# EAGLE design Athena-A1 (EAGLE 9.6.2)

## Sheet 1 of 6
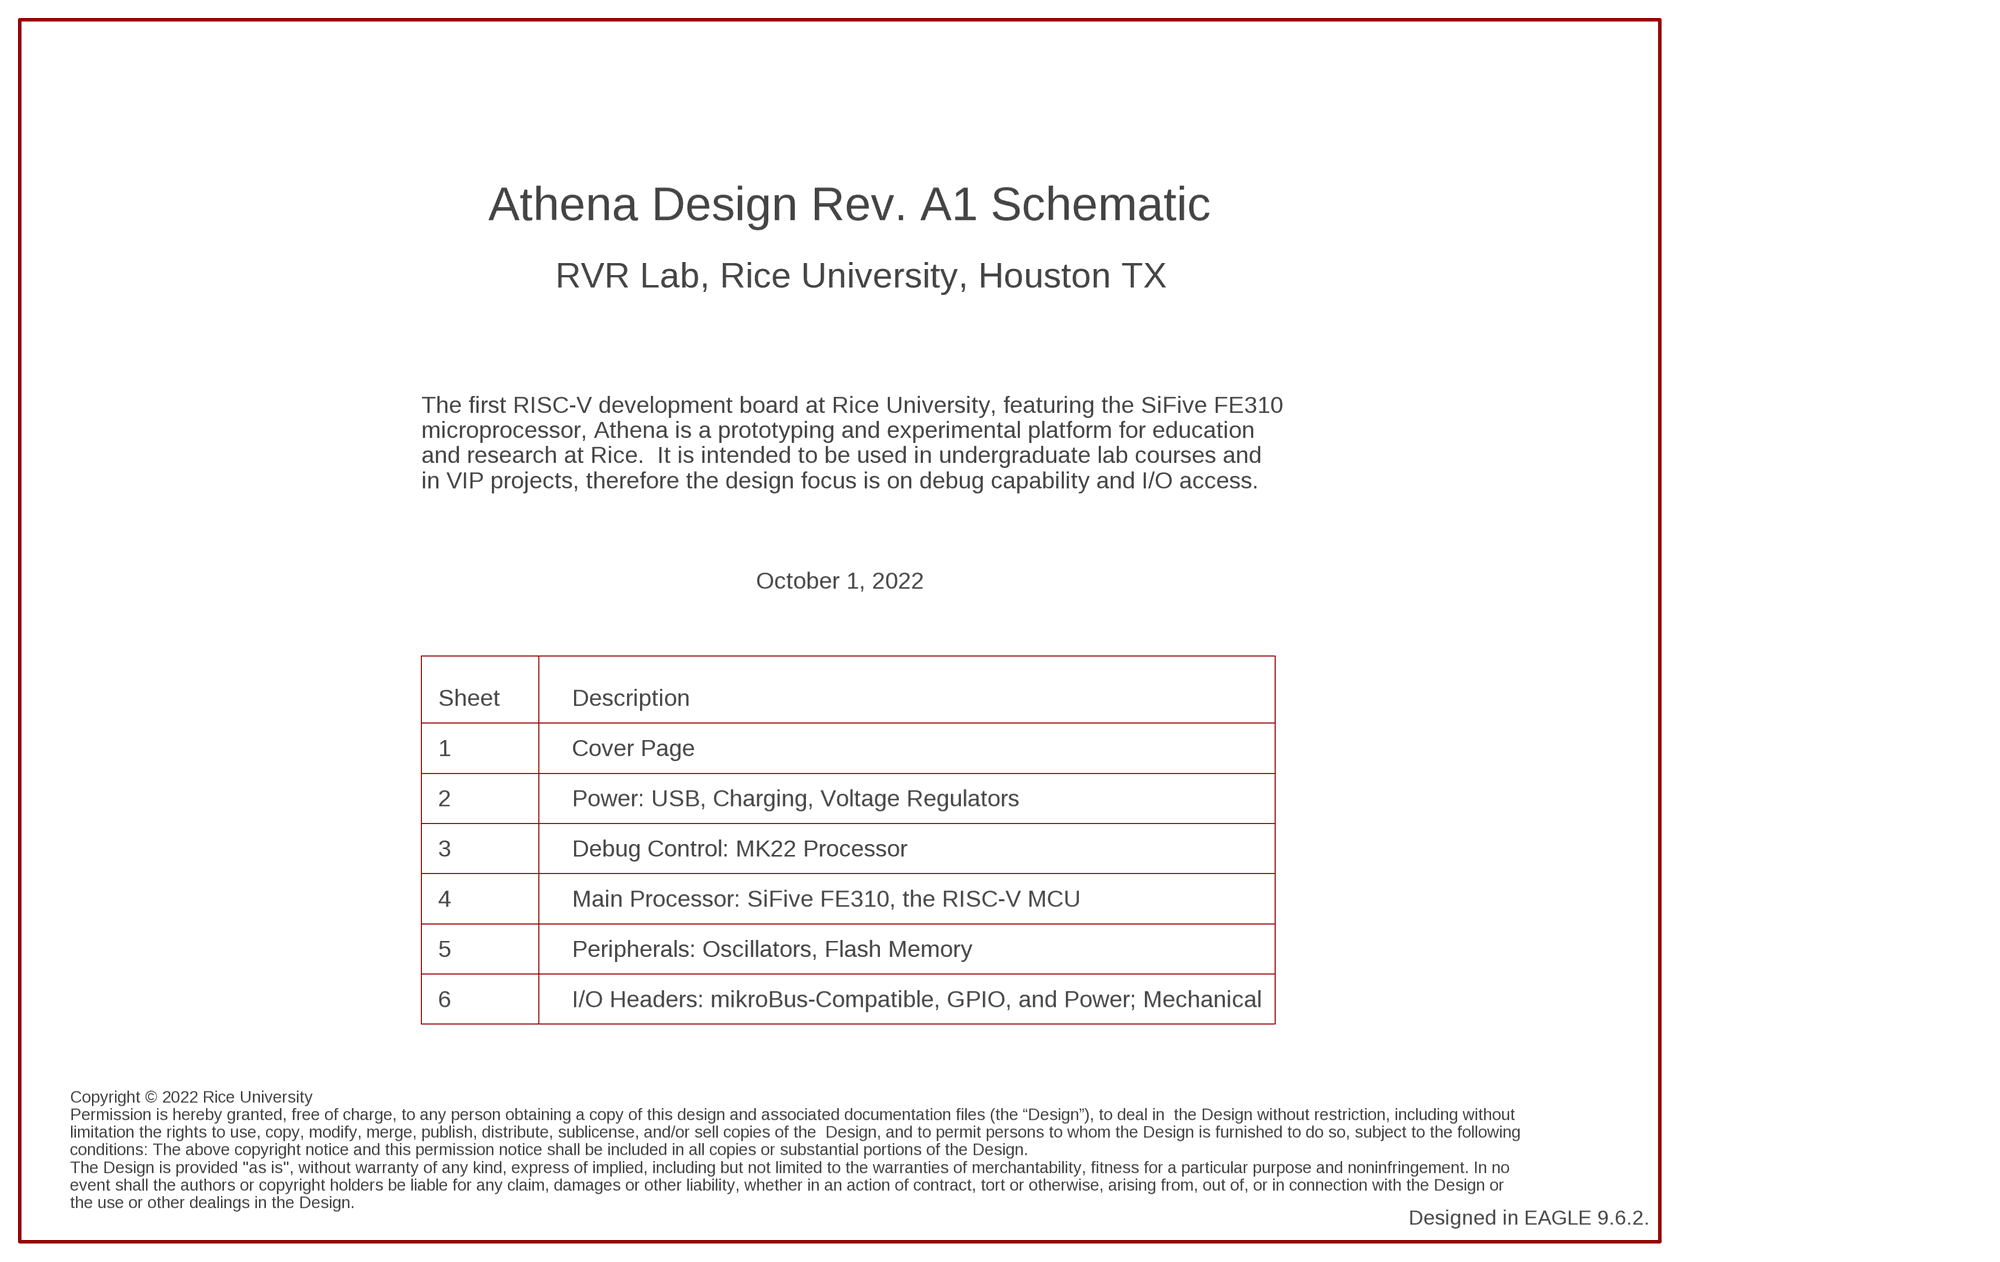
[diagram p0: schematic, sheet 1]

### Notes on the sheet
- Athena Design Rev. A1 Schematic
- RVR Lab, Rice University, Houston TX
- The first RISC-V development board at Rice University, featuring the SiFive FE310
  microprocessor, Athena is a prototyping and experimental platform for education
  and research at Rice.  It is intended to be used in undergraduate lab courses and
  in VIP projects, therefore the design focus is on debug capability and I/O access.
- October 1, 2022
- Sheet | Description
- 1 | Cover Page
- 2 | Power: USB, Charging, Voltage Regulators
- 3 | Debug Control: MK22 Processor
- 4 | Main Processor: SiFive FE310, the RISC-V MCU
- 5 | Peripherals: Oscillators, Flash Memory
- 6 | I/O Headers: mikroBus-Compatible, GPIO, and Power; Mechanical
- Copyright © 2022 Rice University
  Permission is hereby granted, free of charge, to any person obtaining a copy of this design and associated documentation files (the “Design”), to deal in  the Design without restriction, including without 
  limitation the rights to use, copy, modify, merge, publish, distribute, sublicense, and/or sell copies of the  Design, and to permit persons to whom the Design is furnished to do so, subject to the following 
  conditions: The above copyright notice and this permission notice shall be included in all copies or substantial portions of the Design.
  The Design is provided "as is", without warranty of any kind, express of implied, including but not limited to the warranties of merchantability, fitness for a particular purpose and noninfringement. In no 
  event shall the authors or copyright holders be liable for any claim, damages or other liability, whether in an action of contract, tort or otherwise, arising from, out of, or in connection with the Design or 
  the use or other dealings in the Design.
- Designed in EAGLE 9.6.2.

## Sheet 2 of 6
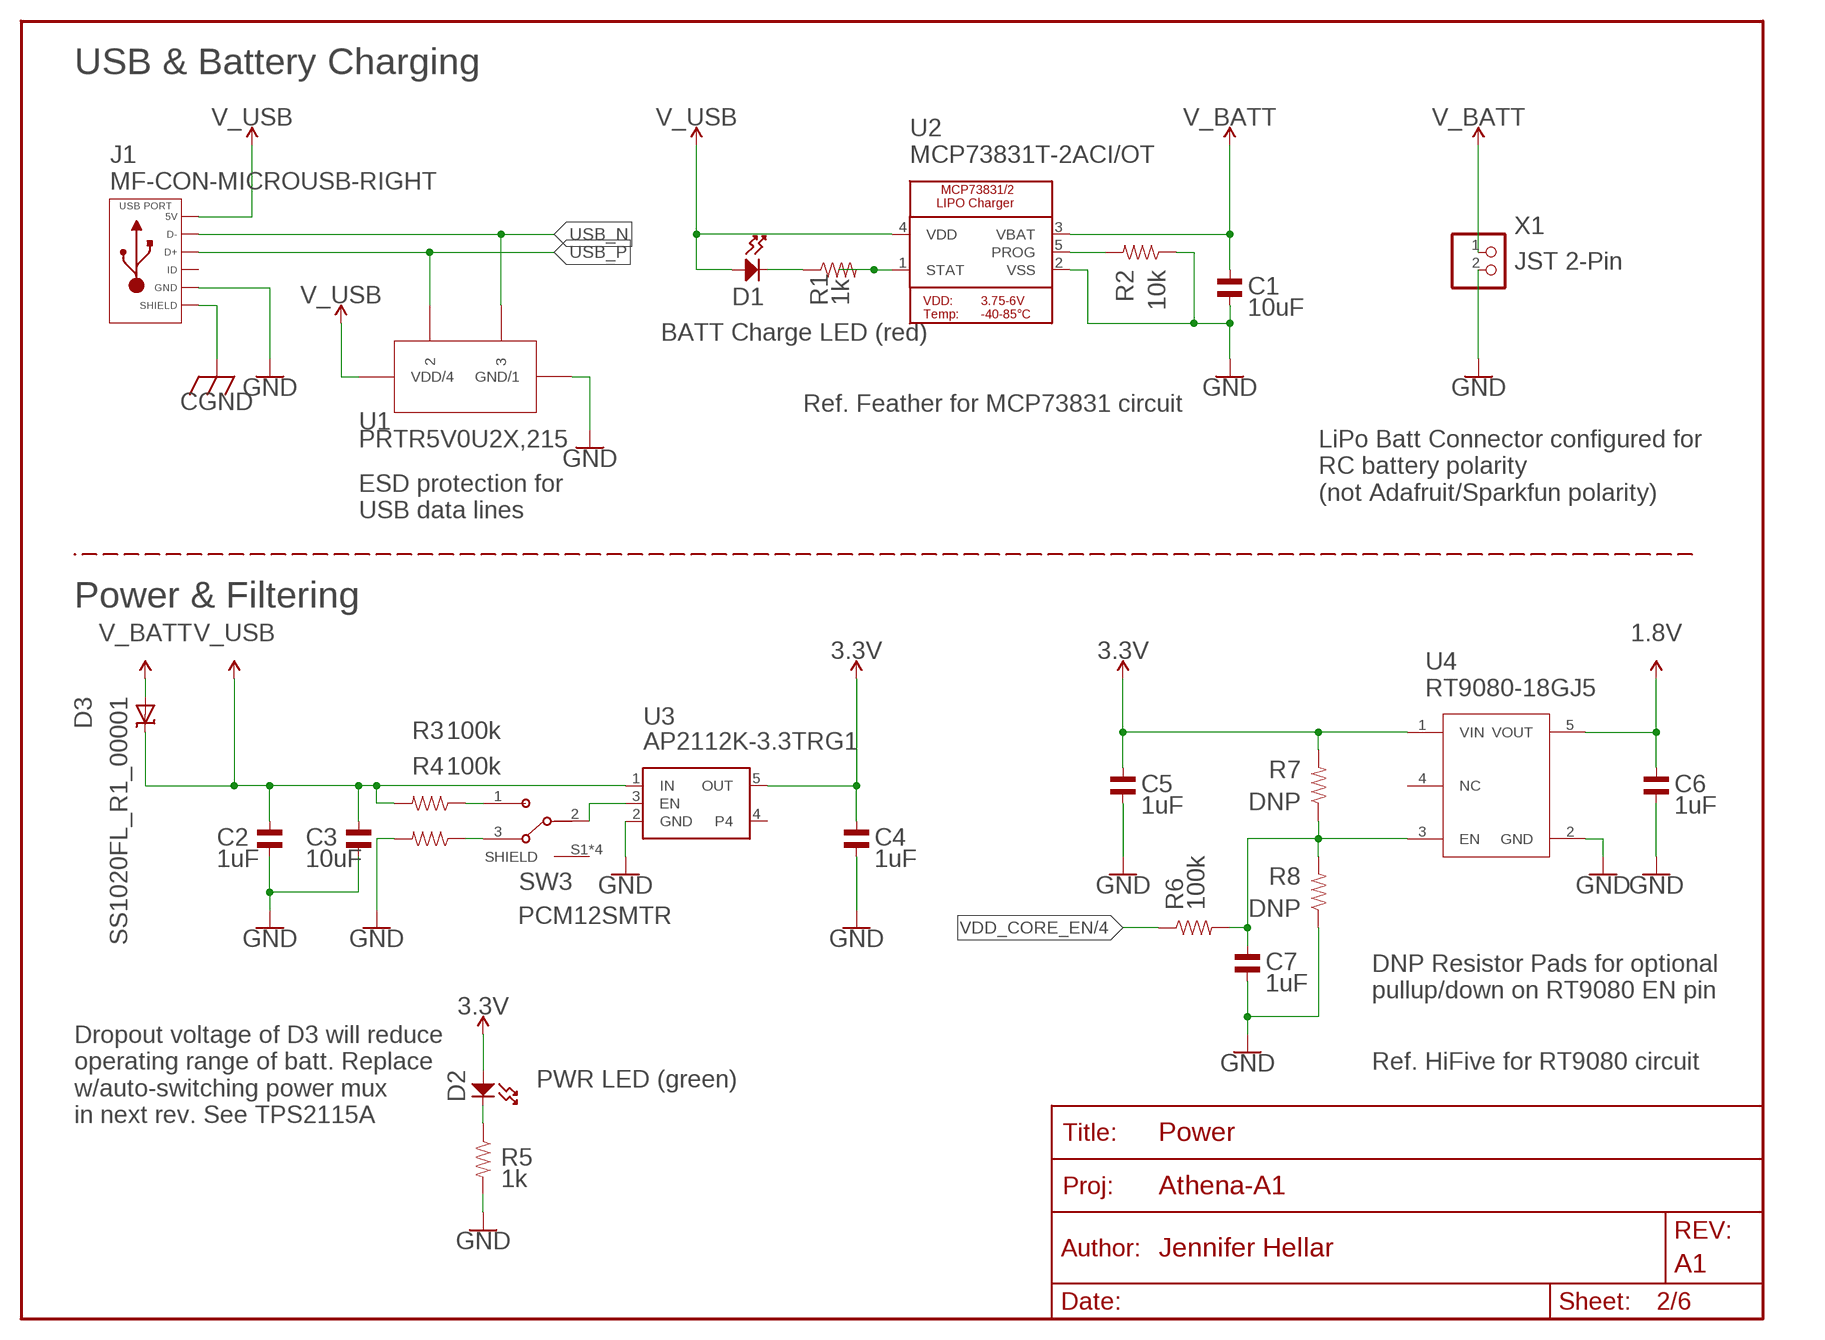
[diagram p1: schematic, sheet 2]
U$6 (FRAME): DESIGNER: Jennifer Hellar; REV: A1; SHEETNM: Power

### Parts
C1  10uF  CAPACITOR_NP_0402  [C0402]
C2  1uF  CAPACITOR_NP_0402  [C0402]
C3  10uF  CAPACITOR_NP_0402  [C0402]
C4  1uF  CAPACITOR_NP_0402  [C0402]
C5  1uF  CAPACITOR_NP_0402  [C0402]
C6  1uF  CAPACITOR_NP_0402  [C0402]
C7  1uF  CAPACITOR_NP_0402  [C0402]
D1  MF-LED-0805-RED  LED_SINGLE-0603-RED  [LED0603]
D2  MF-LED-0603-GREEN  LED_SINGLE-0603-GREEN  [LED0603]
D3  SS1020FL_R1_00001  DIODE-SCHOTTKYSOD-123  [SOD-123]
J1  MF-CON-MICROUSB-RIGHT  USB_MICRO_RIGHT  [MICROUSB-RIGHT]
R1  1k  RESISTOR_0402  [R0402]
R2  10k  RESISTOR_0402  [R0402]
R3  100k  RESISTOR_0402  [R0402]
R4  100k  RESISTOR_0402  [R0402]
R5  1k  RESISTOR_0402  [R0402]
R6  100k  RESISTOR_0402  [R0402]
R7  DNP  RESISTOR_0402  [R0402]
R8  DNP  RESISTOR_0402  [R0402]
SW3  PCM12SMTR  [SW_PCM12SMTR]
U1  PRTR5V0U2X,215  [SOT143B_PRTR5V0U2X,215_NEX]
U2  MCP73831T-2ACI/OT  MCP73831/2  [SOT23-5]
U3  AP2112K-3.3TRG1  AP2112  [SOT23-5]
U4  RT9080-18GJ5  [TSOT23-5_ONS]
X1  JST 2-Pin  CONNECTORS_BATT_JST_PH_2PIN  [JSTPH2]

### Nets
1.8V: C6.P$1 U4.5(VOUT) ; also sheet 4
3.3V: C4.P$1 C5.P$1 D2.ANODE R7.P$2 U3.5(OUT) U4.1(VIN) ; also sheet 3,4,5,6
CGND: J1.S1(SLD) J1.S2(SLD) J1.S3(SLD) J1.S4(SLD) J1.S5(SLD) J1.S6(SLD) ; also sheet 6
GND: C1.P$2 C2.P$2 C3.P$2 C4.P$2 C5.P$2 C6.P$2 C7.P$2 J1.5(GND) R2.P$1 R4.P$2 R5.P$2 R8.P$1 U1.1(GND/1) U2.2(VSS) U3.2(GND) U4.2(GND) X1.2 ; also sheet 3,4,5,6
N$1: R3.P$1 SW3.1
N$2: D2.CATHODE R5.P$1
N$3: D1.CATHODE R1.P$1
N$4: C7.P$1 R6.P$2 R7.P$1 R8.P$2 U4.3(EN)
N$5: R2.P$2 U2.5(PROG)
N$6: R1.P$2 U2.1(STAT)
N$16: SW3.2 U3.3(EN)
N$17: R4.P$1 SW3.3
USB_N [USB]: J1.2(D-) U1.3 ; also sheet 3
USB_P [USB]: J1.3(D+) U1.2 ; also sheet 3
V_BATT: C1.P$1 D3.A U2.3(VBAT) X1.1
V_USB: C2.P$1 C3.P$1 D1.ANODE D3.C J1.1(5V) R3.P$2 U1.4(VDD/4) U2.4(VDD) U3.1(IN) ; also sheet 6
VDD_CORE_EN: R6.P$1 ; also sheet 4
Unconnected: J1.4(ID) SW3.S1(SHIELD) SW3.S2(SHIELD) SW3.S3(SHIELD) SW3.S4(SHIELD) U3.4 U4.4(NC)

### Notes on the sheet
- USB & Battery Charging
- BATT Charge LED (red)
- Ref. Feather for MCP73831 circuit
- LiPo Batt Connector configured for 
  RC battery polarity 
  (not Adafruit/Sparkfun polarity)
- ESD protection for
  USB data lines
- Power & Filtering
- DNP Resistor Pads for optional
  pullup/down on RT9080 EN pin
- Ref. HiFive for RT9080 circuit
- PWR LED (green)
- Dropout voltage of D3 will reduce
  operating range of batt. Replace 
  w/auto-switching power mux
  in next rev. See TPS2115A

## Sheet 3 of 6
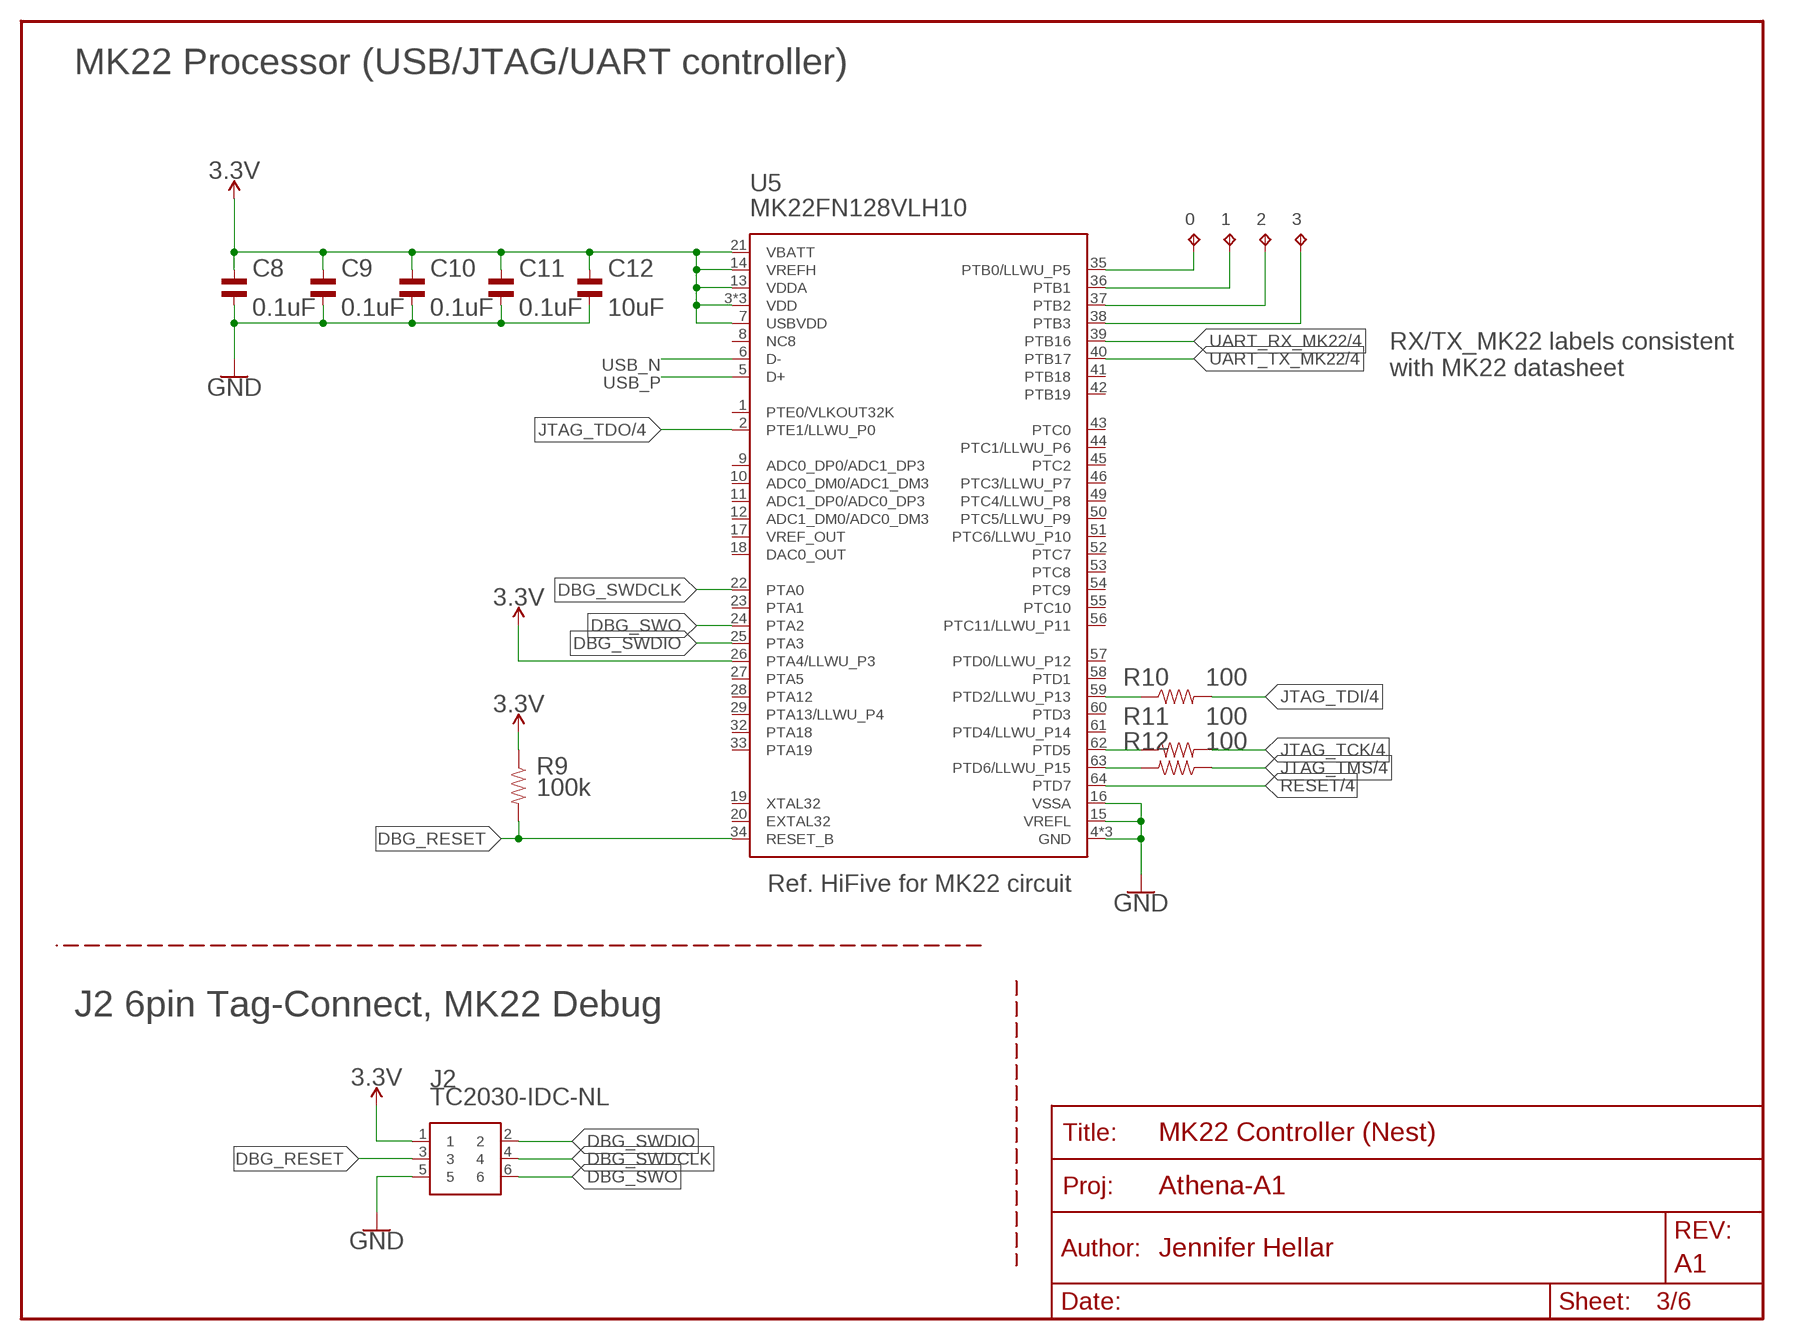
[diagram p2: schematic, sheet 3]
U$7 (FRAME): DESIGNER: Jennifer Hellar; REV: A1; SHEETNM: MK22 Controller (Nest)

### Parts
0  TPB0,65  [TP_B0,65]
1  TPB0,65  [TP_B0,65]
2  TPB0,65  [TP_B0,65]
3  TPB0,65  [TP_B0,65]
C8  0.1uF  CAPACITOR_NP_0402  [C0402]
C9  0.1uF  CAPACITOR_NP_0402  [C0402]
C10  0.1uF  CAPACITOR_NP_0402  [C0402]
C11  0.1uF  CAPACITOR_NP_0402  [C0402]
C12  10uF  CAPACITOR_NP_0402  [C0402]
J2  TC2030-IDC-NL  [TAG_TC2030-IDC-NL]
R9  100k  RESISTOR_0402  [R0402]
R10  100  RESISTOR_0402  [R0402]
R11  100  RESISTOR_0402  [R0402]
R12  100  RESISTOR_0402  [R0402]
U5  MK22FN128VLH10  [IC_USB_JTAG_LQFP-64]

### Nets
3.3V: C8.P$1 C9.P$1 C10.P$1 C11.P$1 C12.P$1 J2.1 R9.P$1 U5.3(VDD) U5.7(USBVDD) U5.13(VDDA) U5.14(VREFH) U5.21(VBATT) U5.26(PTA4/LLWU_P3) U5.30(VDD) U5.48(VDD) ; also sheet 2,4,5,6
DBG_RESET [USB]: J2.3 R9.P$2 U5.34(RESET_B)
DBG_SWDCLK: J2.4 U5.22(PTA0)
DBG_SWDIO: J2.2 U5.25(PTA3)
DBG_SWO: J2.6 U5.24(PTA2)
GND: C8.P$2 C9.P$2 C10.P$2 C11.P$2 C12.P$2 J2.5 U5.4(GND) U5.15(VREFL) U5.16(VSSA) U5.31(GND) U5.47(GND) ; also sheet 2,4,5,6
JTAG_TCK: R11.P$2 ; also sheet 4
JTAG_TDI: R10.P$2 ; also sheet 4
JTAG_TDO: U5.2(PTE1/LLWU_P0) ; also sheet 4
JTAG_TMS: R12.P$1 ; also sheet 4
N$8: R12.P$2 U5.63(PTD6/LLWU_P15)
N$9: R11.P$1 U5.62(PTD5)
N$11: R10.P$1 U5.59(PTD2/LLWU_P13)
N$12: 0.TP U5.35(PTB0/LLWU_P5)
N$13: 1.TP U5.36(PTB1)
N$14: 2.TP U5.37(PTB2)
N$15: 3.TP U5.38(PTB3)
RESET: U5.64(PTD7) ; also sheet 4
UART_RX_MK22: U5.39(PTB16) ; also sheet 4
UART_TX_MK22: U5.40(PTB17) ; also sheet 4
USB_N [USB]: U5.6(D-) ; also sheet 2
USB_P [USB]: U5.5(D+) ; also sheet 2
Unconnected: U5.1(PTE0/VLKOUT32K) U5.8(NC8) U5.9(ADC0_DP0/ADC1_DP3) U5.10(ADC0_DM0/ADC1_DM3) U5.11(ADC1_DP0/ADC0_DP3) U5.12(ADC1_DM0/ADC0_DM3) U5.17(VREF_OUT) U5.18(DAC0_OUT) U5.19(XTAL32) U5.20(EXTAL32) U5.23(PTA1) U5.27(PTA5) U5.28(PTA12) U5.29(PTA13/LLWU_P4) U5.32(PTA18) U5.33(PTA19) U5.41(PTB18) U5.42(PTB19) U5.43(PTC0) U5.44(PTC1/LLWU_P6) U5.45(PTC2) U5.46(PTC3/LLWU_P7) U5.49(PTC4/LLWU_P8) U5.50(PTC5/LLWU_P9) U5.51(PTC6/LLWU_P10) U5.52(PTC7) U5.53(PTC8) U5.54(PTC9) U5.55(PTC10) U5.56(PTC11/LLWU_P11) U5.57(PTD0/LLWU_P12) U5.58(PTD1) U5.60(PTD3) U5.61(PTD4/LLWU_P14)

### Notes on the sheet
- MK22 Processor (USB/JTAG/UART controller)
- RX/TX_MK22 labels consistent
  with MK22 datasheet
- Ref. HiFive for MK22 circuit
- J2 6pin Tag-Connect, MK22 Debug

## Sheet 4 of 6
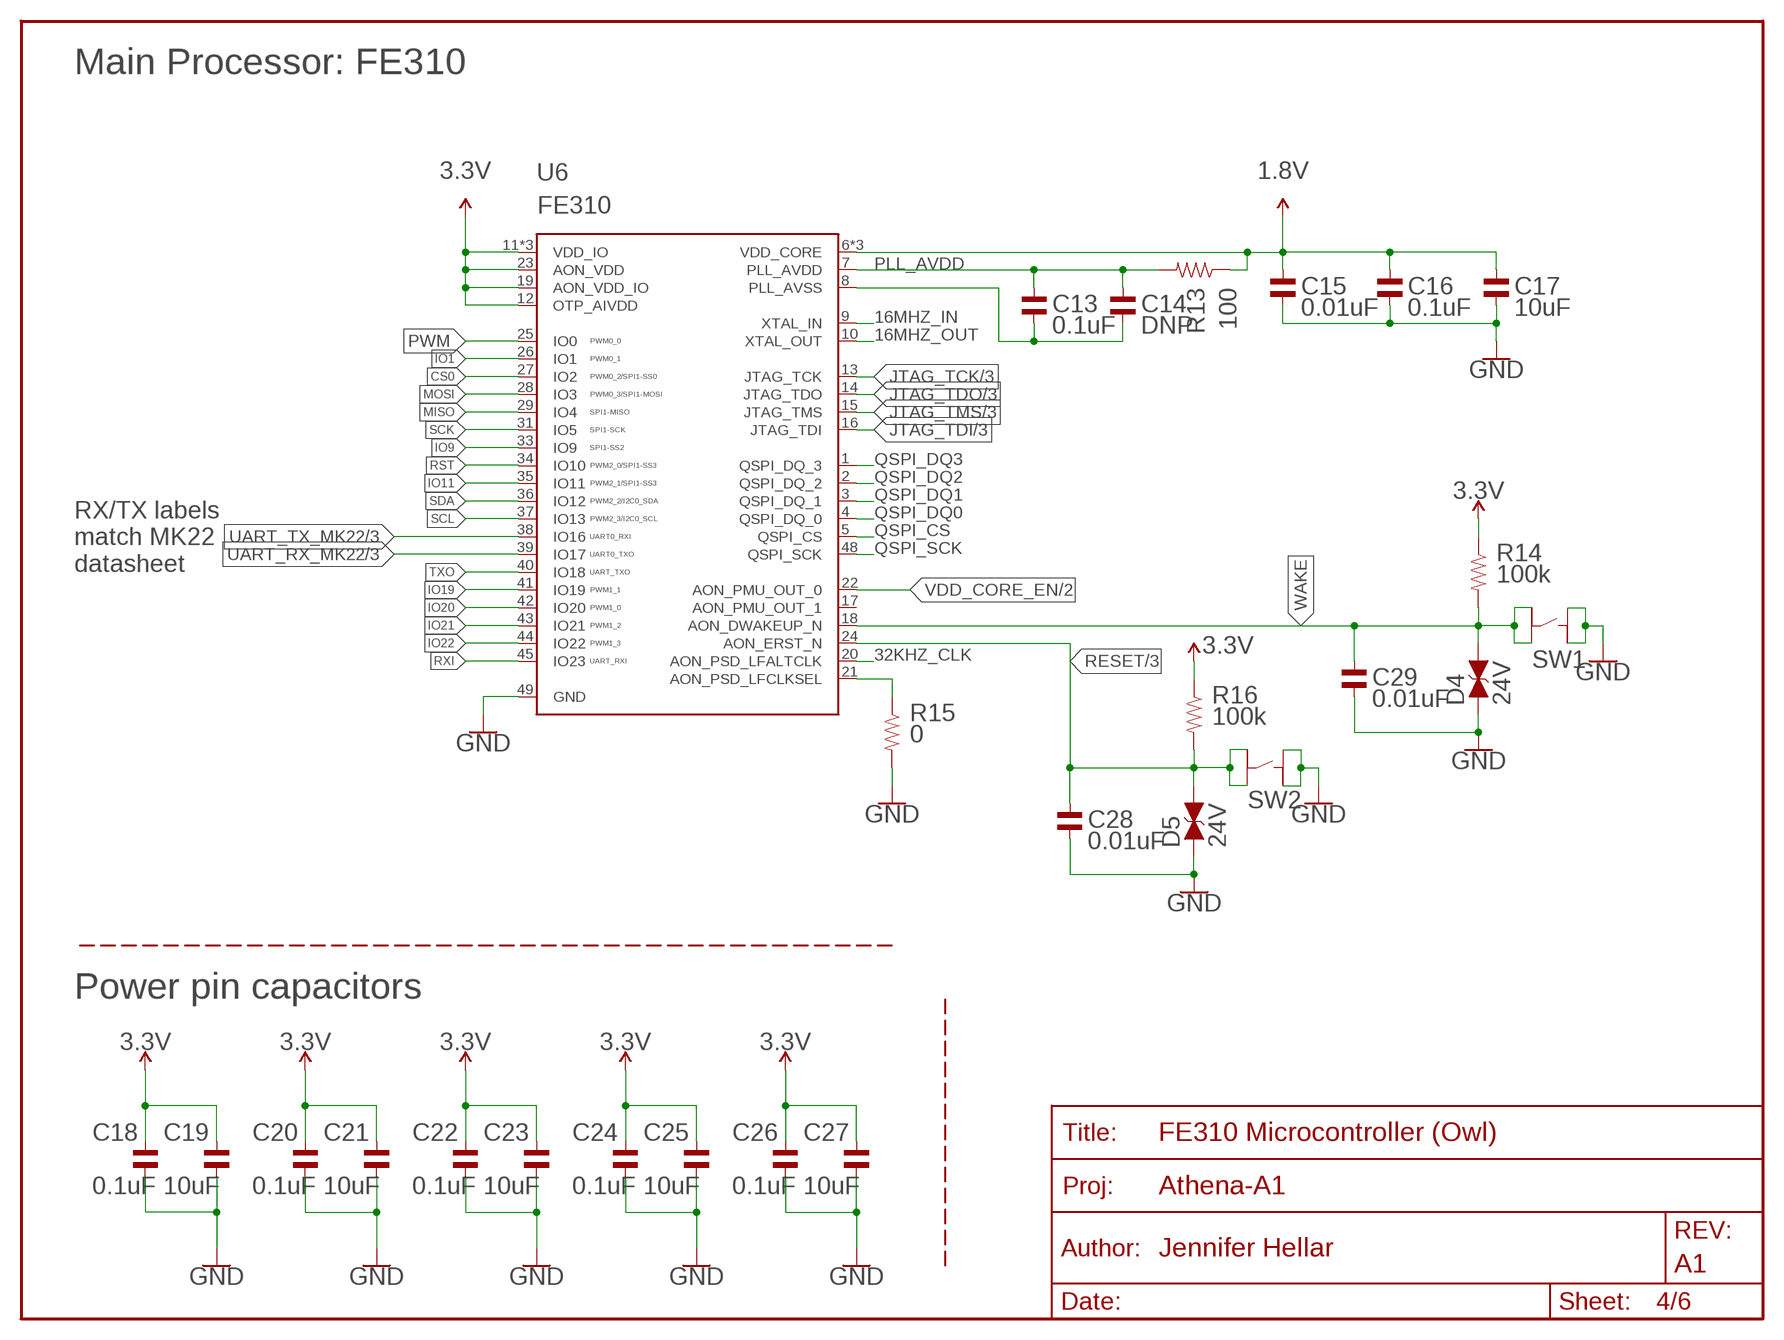
[diagram p3: schematic, sheet 4]
U$9 (FRAME): DESIGNER: Jennifer Hellar; REV: A1; SHEETNM: FE310 Microcontroller (Owl)

### Parts
C13  0.1uF  CAPACITOR_NP_0402  [C0402]
C14  DNP  CAPACITOR_NP_0402  [C0402]
C15  0.01uF  CAPACITOR_NP_0402  [C0402]
C16  0.1uF  CAPACITOR_NP_0402  [C0402]
C17  10uF  CAPACITOR_NP_0402  [C0402]
C18  0.1uF  CAPACITOR_NP_0402  [C0402]
C19  10uF  CAPACITOR_NP_0402  [C0402]
C20  0.1uF  CAPACITOR_NP_0402  [C0402]
C21  10uF  CAPACITOR_NP_0402  [C0402]
C22  0.1uF  CAPACITOR_NP_0402  [C0402]
C23  10uF  CAPACITOR_NP_0402  [C0402]
C24  0.1uF  CAPACITOR_NP_0402  [C0402]
C25  10uF  CAPACITOR_NP_0402  [C0402]
C26  0.1uF  CAPACITOR_NP_0402  [C0402]
C27  10uF  CAPACITOR_NP_0402  [C0402]
C28  0.01uF  CAPACITOR_NP_0402  [C0402]
C29  0.01uF  CAPACITOR_NP_0402  [C0402]
D4  24V  PESD0603-240TVS0603  [TVS0603]
D5  24V  PESD0603-240TVS0603  [TVS0603]
R13  100  RESISTOR_0402  [R0402]
R14  100k  RESISTOR_0402  [R0402]
R15  0  RESISTOR_0402  [R0402]
R16  100k  RESISTOR_0402  [R0402]
SW1  MF-SW-TACT-6MM  TACT_4.2MM  [TACT4.2MM]
SW2  MF-SW-TACT-6MM  TACT_4.2MM  [TACT4.2MM]
U6  FE310  IC_MCU_SIFIVE_FE310  [MCU_QFN-48-.4MMPITCH]

### Nets
1.8V: C15.P$1 C16.P$1 C17.P$1 R13.P$1 U6.6(VDD_CORE) U6.30(VDD_CORE) U6.46(VDD_CORE) ; also sheet 2
3.3V: C18.P$1 C19.P$1 C20.P$1 C21.P$1 C22.P$1 C23.P$1 C24.P$1 C25.P$1 C26.P$1 C27.P$1 R14.P$1 R16.P$1 U6.11(VDD_IO) U6.12(OTP_AIVDD) U6.19(AON_VDD_IO) U6.23(AON_VDD) U6.32(VDD_IO) U6.47(VDD_IO) ; also sheet 2,3,5,6
16MHZ_IN: U6.9(XTAL_IN) ; also sheet 5
16MHZ_OUT: U6.10(XTAL_OUT) ; also sheet 5
32KHZ_CLK: U6.20(AON_PSD_LFALTCLK) ; also sheet 5
CS0: U6.27(IO2) ; also sheet 6
GND: C15.P$2 C16.P$2 C17.P$2 C18.P$2 C19.P$2 C20.P$2 C21.P$2 C22.P$2 C23.P$2 C24.P$2 C25.P$2 C26.P$2 C27.P$2 C28.P$2 C29.P$2 D4.1(A) D5.1(A) R15.P$2 SW1.P$1 SW1.P$2 SW2.P$1 SW2.P$2 U6.49(GND) ; also sheet 2,3,5,6
IO1: U6.26(IO1) ; also sheet 6
IO9: U6.33(IO9) ; also sheet 6
IO11: U6.35(IO11) ; also sheet 6
IO19: U6.41(IO19) ; also sheet 6
IO20: U6.42(IO20) ; also sheet 6
IO21: U6.43(IO21) ; also sheet 6
IO22: U6.44(IO22) ; also sheet 6
JTAG_TCK: U6.13(JTAG_TCK) ; also sheet 3
JTAG_TDI: U6.16(JTAG_TDI) ; also sheet 3
JTAG_TDO: U6.14(JTAG_TDO) ; also sheet 3
JTAG_TMS: U6.15(JTAG_TMS) ; also sheet 3
MISO: U6.29(IO4) ; also sheet 6
MOSI: U6.28(IO3) ; also sheet 6
N$7: R15.P$1 U6.21(AON_PSD_LFCLKSEL)
N$10: C13.P$2 C14.P$2 U6.8(PLL_AVSS)
PLL_AVDD: C13.P$1 C14.P$1 R13.P$2 U6.7(PLL_AVDD)
PWM: U6.25(IO0) ; also sheet 6
QSPI_CS [QSPI]: U6.5(QSPI_CS) ; also sheet 5
QSPI_DQ0 [QSPI]: U6.4(QSPI_DQ_0) ; also sheet 5
QSPI_DQ1 [QSPI]: U6.3(QSPI_DQ_1) ; also sheet 5
QSPI_DQ2 [QSPI]: U6.2(QSPI_DQ_2) ; also sheet 5
QSPI_DQ3 [QSPI]: U6.1(QSPI_DQ_3) ; also sheet 5
QSPI_SCK [QSPI]: U6.48(QSPI_SCK) ; also sheet 5
RESET: C28.P$1 D5.2(C) R16.P$2 SW2.P$3 SW2.P$4 U6.24(AON_ERST_N) ; also sheet 3
RST: U6.34(IO10) ; also sheet 6
RXI: U6.45(IO23) ; also sheet 6
SCK: U6.31(IO5) ; also sheet 6
SCL: U6.37(IO13) ; also sheet 6
SDA: U6.36(IO12) ; also sheet 6
TXO: U6.40(IO18) ; also sheet 6
UART_RX_MK22: U6.39(IO17) ; also sheet 3
UART_TX_MK22: U6.38(IO16) ; also sheet 3
VDD_CORE_EN: U6.22(AON_PMU_OUT_0) ; also sheet 2
WAKE: C29.P$1 D4.2(C) R14.P$2 SW1.P$3 SW1.P$4 U6.18(AON_DWAKEUP_N)
Unconnected: U6.17(AON_PMU_OUT_1)

### Notes on the sheet
- Main Processor: FE310
- RX/TX labels
  match MK22
  datasheet
- Power pin capacitors

## Sheet 5 of 6
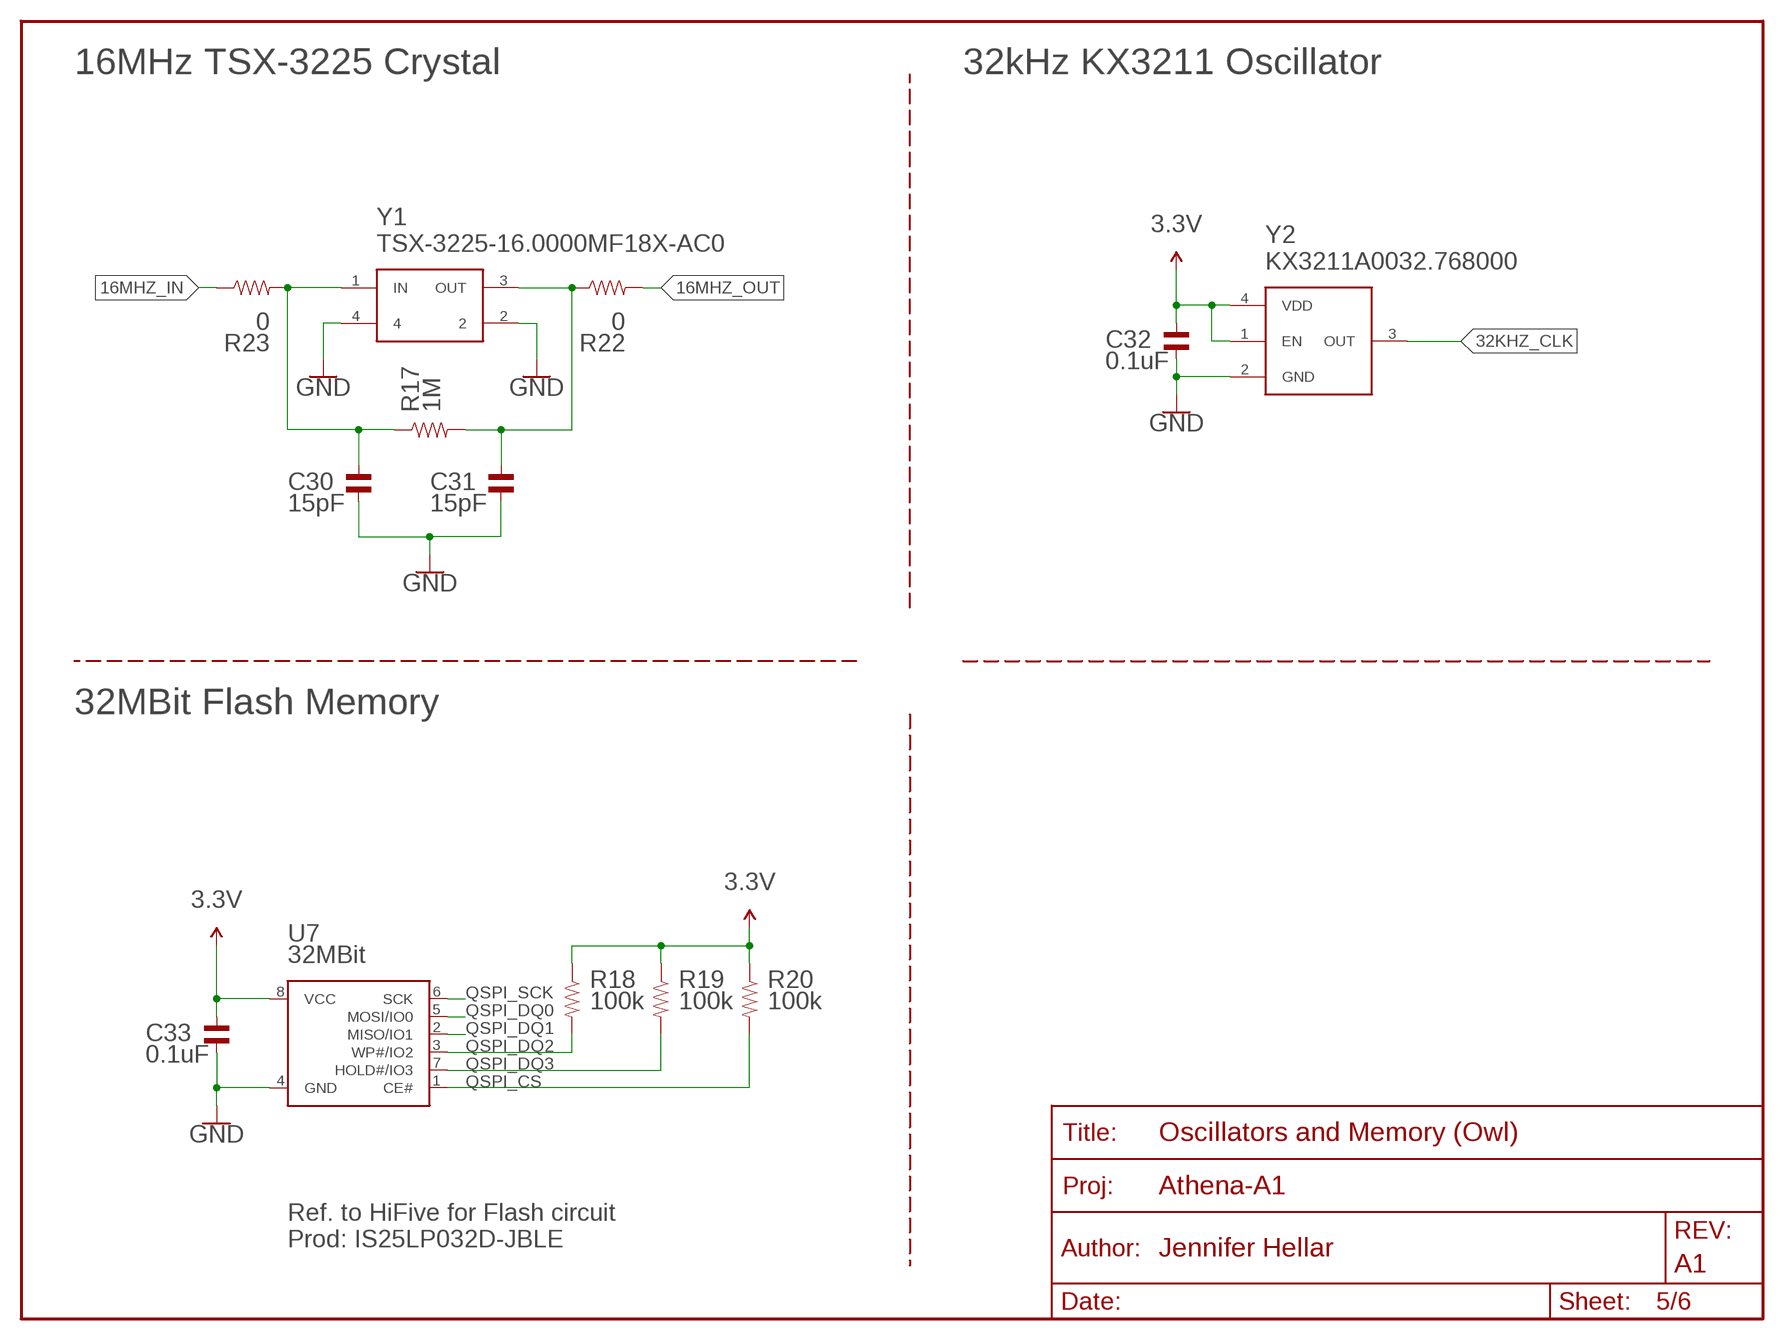
[diagram p4: schematic, sheet 5]
U$10 (FRAME): DESIGNER: Jennifer Hellar; REV: A1; SHEETNM: Oscillators and Memory (Owl)

### Parts
C30  15pF  CAPACITOR_NP_0402  [C0402]
C31  15pF  CAPACITOR_NP_0402  [C0402]
C32  0.1uF  CAPACITOR_NP_0402  [C0402]
C33  0.1uF  CAPACITOR_NP_0402  [C0402]
R17  1M  RESISTOR_0402  [R0402]
R18  100k  RESISTOR_0402  [R0402]
R19  100k  RESISTOR_0402  [R0402]
R20  100k  RESISTOR_0402  [R0402]
R22  0  RESISTOR_0402  [R0402]
R23  0  RESISTOR_0402  [R0402]
U7  32MBit  IC_MEMORY_QSPI32MBIT  [IC-MEMORY_SO08]
Y1  TSX-3225-16.0000MF18X-AC0  [SMD-4]
Y2  KX3211A0032.768000  [SMD-4]

### Nets
3.3V: C32.P$1 C33.P$1 R18.P$1 R19.P$1 R20.P$1 U7.8(VCC) Y2.1(EN) Y2.4(VDD) ; also sheet 2,3,4,6
16MHZ_IN: R23.P$1 ; also sheet 4
16MHZ_OUT: R22.P$2 ; also sheet 4
32KHZ_CLK: Y2.3(OUT) ; also sheet 4
GND: C30.P$2 C31.P$2 C32.P$2 C33.P$2 U7.4(GND) Y1.2 Y1.4 Y2.2(GND) ; also sheet 2,3,4,6
N$18: C30.P$1 R17.P$1 R23.P$2 Y1.1(IN)
N$19: C31.P$1 R17.P$2 R22.P$1 Y1.3(OUT)
QSPI_CS [QSPI]: R20.P$2 U7.1(CE#) ; also sheet 4
QSPI_DQ0 [QSPI]: U7.5(MOSI/IO0) ; also sheet 4
QSPI_DQ1 [QSPI]: U7.2(MISO/IO1) ; also sheet 4
QSPI_DQ2 [QSPI]: R18.P$2 U7.3(WP#/IO2) ; also sheet 4
QSPI_DQ3 [QSPI]: R19.P$2 U7.7(HOLD#/IO3) ; also sheet 4
QSPI_SCK [QSPI]: U7.6(SCK) ; also sheet 4

### Notes on the sheet
- 16MHz TSX-3225 Crystal | 32kHz KX3211 Oscillator
- 32MBit Flash Memory
- Ref. to HiFive for Flash circuit
  Prod: IS25LP032D-JBLE

## Sheet 6 of 6
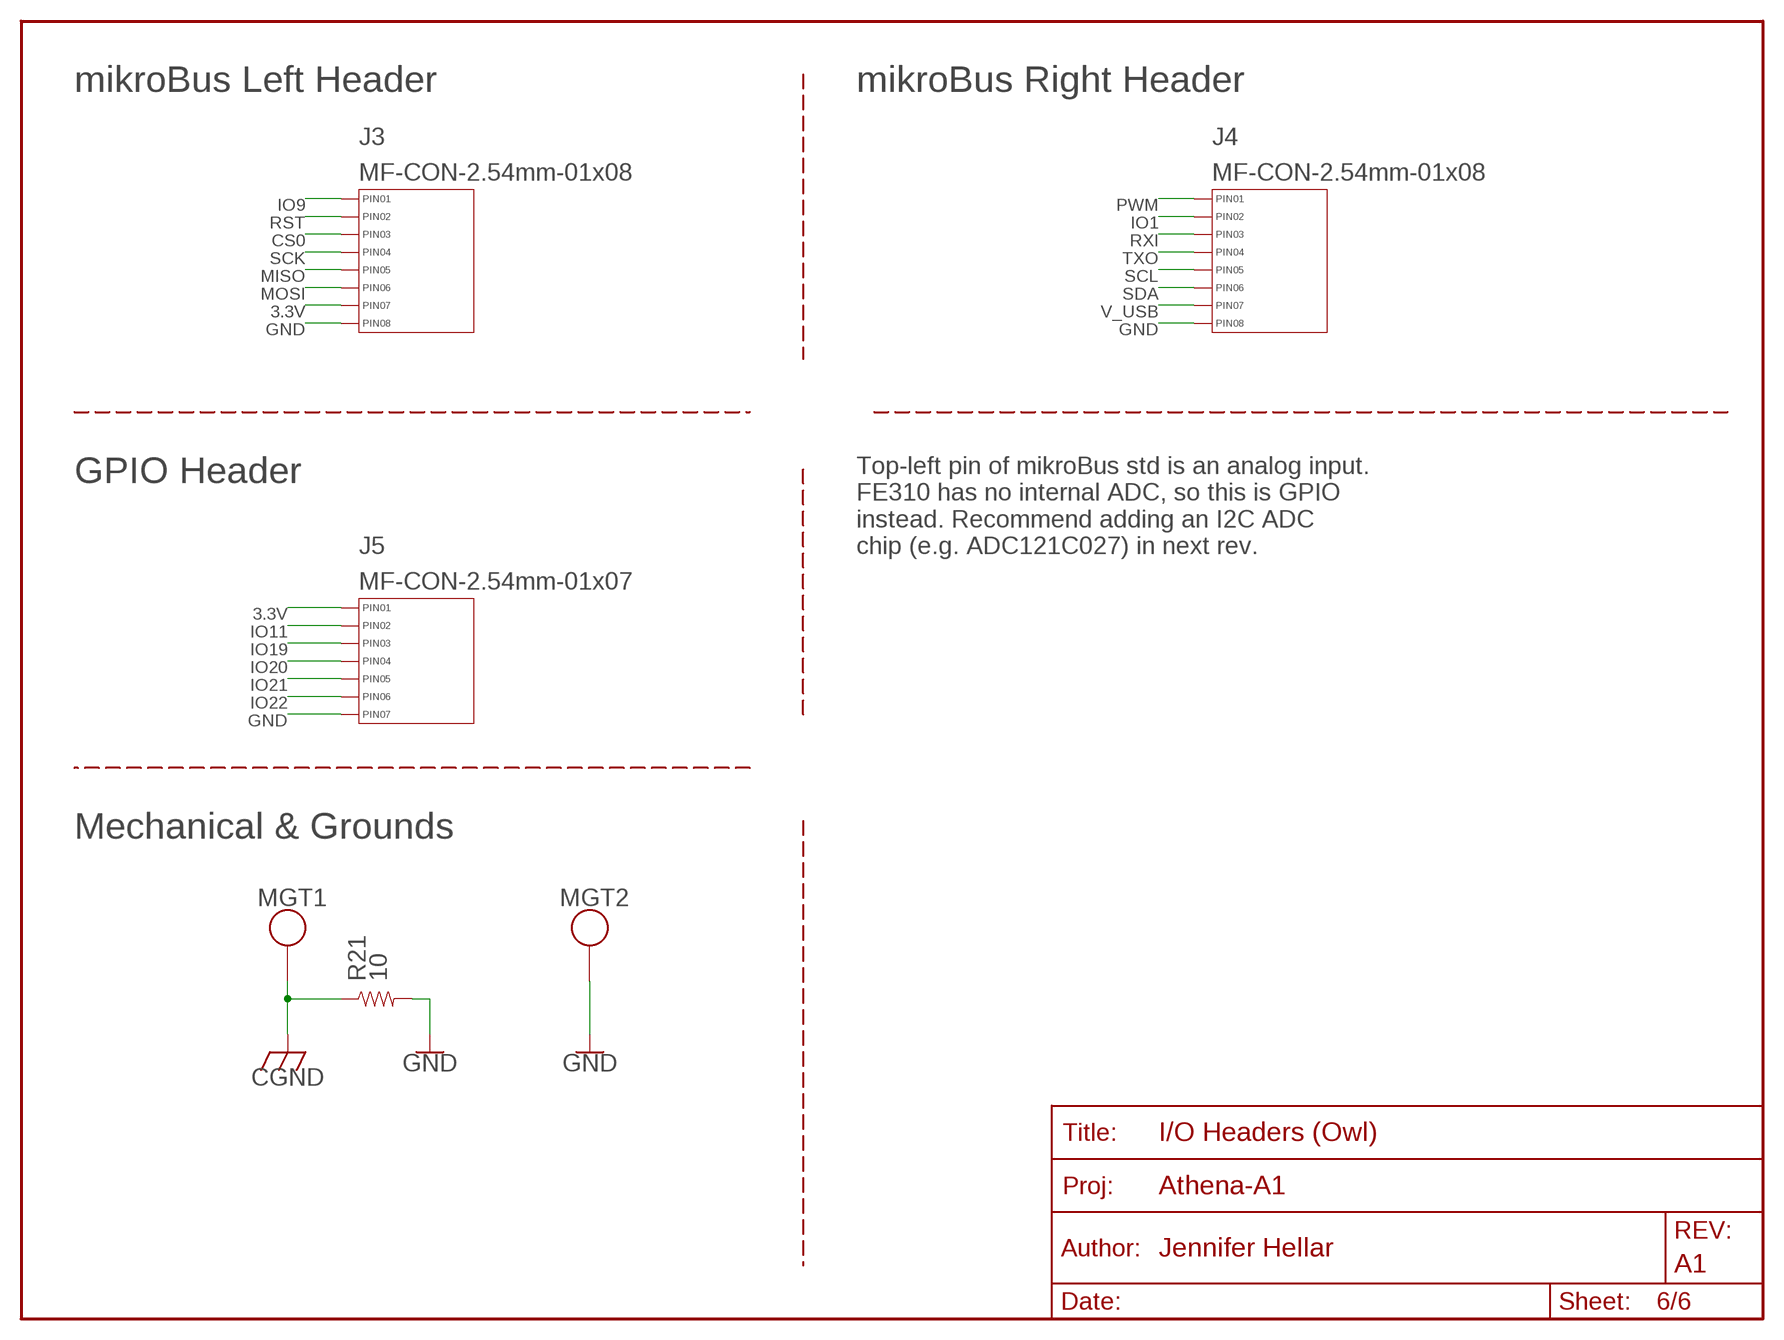
[diagram p5: schematic, sheet 6]
U$11 (FRAME): DESIGNER: Jennifer Hellar; REV: A1; SHEETNM: I/O Headers (Owl)

### Parts
J3  MF-CON-2.54mm-01x08  CON_01X08_PTH_2.54MM  [PTH_2.54MM_01X08]
J4  MF-CON-2.54mm-01x08  CON_01X08_PTH_2.54MM  [PTH_2.54MM_01X08]
J5  MF-CON-2.54mm-01x07  CON_01X07_PTH_2.54MM  [PTH_2.54MM_01X07]
MGT1  MOUNTING_HOLE  [MOUNTING_HOLE]
MGT2  MOUNTING_HOLE  [MOUNTING_HOLE]
R21  10  RESISTOR_0402  [R0402]

### Nets
3.3V: J3.P$7(PIN7) J5.P$1(PIN1) ; also sheet 2,3,4,5
CGND: MGT1.P$1 R21.P$1 ; also sheet 2
CS0: J3.P$3(PIN3) ; also sheet 4
GND: J3.P$8(PIN8) J4.P$8(PIN8) J5.P$7(PIN7) MGT2.P$1 R21.P$2 ; also sheet 2,3,4,5
IO1: J4.P$2(PIN2) ; also sheet 4
IO9: J3.P$1(PIN1) ; also sheet 4
IO11: J5.P$2(PIN2) ; also sheet 4
IO19: J5.P$3(PIN3) ; also sheet 4
IO20: J5.P$4(PIN4) ; also sheet 4
IO21: J5.P$5(PIN5) ; also sheet 4
IO22: J5.P$6(PIN6) ; also sheet 4
MISO: J3.P$5(PIN5) ; also sheet 4
MOSI: J3.P$6(PIN6) ; also sheet 4
PWM: J4.P$1(PIN1) ; also sheet 4
RST: J3.P$2(PIN2) ; also sheet 4
RXI: J4.P$3(PIN3) ; also sheet 4
SCK: J3.P$4(PIN4) ; also sheet 4
SCL: J4.P$5(PIN5) ; also sheet 4
SDA: J4.P$6(PIN6) ; also sheet 4
TXO: J4.P$4(PIN4) ; also sheet 4
V_USB: J4.P$7(PIN7) ; also sheet 2

### Notes on the sheet
- mikroBus Left Header | mikroBus Right Header
- GPIO Header
- Top-left pin of mikroBus std is an analog input.
  FE310 has no internal ADC, so this is GPIO
  instead. Recommend adding an I2C ADC 
  chip (e.g. ADC121C027) in next rev.
- Mechanical & Grounds

## Library data of the parts
0 1-3 = Athena-A1:TP: Test pad
C1 C3 C12 C17 C19 C21 C23 C25 C27 = Athena-A1:CAPACITOR_NP: Library: MF_Passives Description: Device for Non-Polarized Capacitors. Manufacture part number (MPN) can be added via Attributes. Check https://factory.macrofab.com/parts for the house parts list.; MPN: CL05A106MP8NUB8; POPULATE: 1
C2 C4-C11 C13-C16 C18 C20 C22 C24 C26 C28 C29 C32 C33 = Athena-A1:CAPACITOR_NP: Library: MF_Passives Description: Device for Non-Polarized Capacitors. Manufacture part number (MPN) can be added via Attributes. Check https://factory.macrofab.com/parts for the house parts list.; POPULATE: 1
C30 C31 = Athena-A1:CAPACITOR_NP: Library: MF_Passives Description: Device for Non-Polarized Capacitors. Manufacture part number (MPN) can be added via Attributes. Check https://factory.macrofab.com/parts for the house parts list.; MPN: CL05C150JB5NNNC; POPULATE: 1
D1 = Athena-A1:LED_SINGLE: Library: MF_LEDs Description: Device for Single LED Packages. Manufacture part number (MFG#) can be added via Attributes.; HOUSEPART: YES; MPN: MF-LED-0805-RED; POPULATE: 1; URL: https://factory.macrofab.com/part/MF-LED-0805-RED
D2 = Athena-A1:LED_SINGLE: Library: MF_LEDs Description: Device for Single LED Packages. Manufacture part number (MFG#) can be added via Attributes.; HOUSEPART: YES; MPN: MF-LED-0603-GREEN; POPULATE: 1; URL: https://factory.macrofab.com/part/MF-LED-0603-GREEN
D3 = Athena-A1:DIODE-SCHOTTKY
D4 D5 = Athena-A1:PESD0603-240; PROD_ID: DIO-14502
J1 = Athena-A1:USB: Library: MF_Connectors Description: 5 Pin USB Connectors. SLD is the shield connection. Usually tied to ground through a small ferrite bead.; HOUSEPART: YES; HUOSEPART: NO; POPULATE: 1; URL: http://www.4uconnector.com/online/object/4udrawing/20236.pdf
J2 = Athena-A1:TC2030-IDC-NL: CABLE ADAPTER 6 POS Check prices <https://pricing.snapeda.com/parts/TC2030-IDC-NL/Tag-Connect/view-part?ref=eda>; AVAILABILITY: No availability data; DESCRIPTION: 6-PIN PLUG-OF-NAILS CABLE 6; MF: Tag-Connect; MP: TC2030-IDC-NL; PACKAGE: None; PRICE: None
J3 J4 = Athena-A1:CON_01X08: Library: MF_Connectors Description: Header Connector with 8 Positions and 01 Rows. Use the LABEL Attribute to label the pin on the schematic and PCB. You can remove the attributes on the PCB by using the SMASH function on the part and then deleting the text.; HOUSEPART: YES; MPN: MF-CON-2.54mm-01x08; POPULATE: 1; URL: https://factory.macrofab.com/part/MF-CON-2.54mm-01x08
J5 = Athena-A1:CON_01X07: Library: MF_Connectors Description: Header Connector with 7 Positions and 01 Rows. Use the LABEL Attribute to label the pin on the schematic and PCB. You can remove the attributes on the PCB by using the SMASH function on the part and then deleting the text.; HOUSEPART: YES; MPN: MF-CON-2.54mm-01x07; POPULATE: 1; URL: https://factory.macrofab.com/part/MF-CON-2.54mm-01x07
MGT1 MGT2 = Athena-A1:MOUNTING_HOLE: Chassis Mounting Hole w/GND connection ability
R1-R23 = Athena-A1:RESISTOR: Library: MF_Passives Description: Device for Resistors. Manufacture part number (MPN), Voltage, Tolerance, and Wattage Rating can be added via Attributes. Check https://factory.macrofab.com/parts for the house parts list.
SW1 SW2 = Athena-A1:TACT: Library: MF_Switches Description: Device for Tact Switches. Manufacture part number (MFG#) can be added via Attributes.; HOUSEPART: YES; MPN: MF-SW-TACT-6MM; POPULATE: 1; URL: https://factory.macrofab.com/part/MF-SW-TACT-6MM
SW3 = Athena-A1:PCM12SMTR: Switch Slide ON ON SPDT Side Slide 0.3A 6VDC 10000Cycles Gull Wing SMD T/R; DESCRIPTION: Slide Switch SPDT Surface Mount, Right Angle; DIGI-KEY_PART_NUMBER: 401-2016-2-ND; MF: C&K; MP: PCM12SMTR; PACKAGE: None; PURCHASE-URL: https://pricing.snapeda.com/search/part/PCM12SMTR/?ref=eda
U1 = Athena-A1:PRTR5V0U2X,215; COPYRIGHT: Copyright (C) 2021 Ultra Librarian. All rights reserved.; MANUFACTURER_PART_NUMBER: PRTR5V0U2X,215; MFR_NAME: Nexperia
U2 = Athena-A1:MCP73831/2: MCP73831/2 LIPO Charger VDD: 3.75 - 6V Temp -40 - 85°C Programmable Charge Rate: 15-500mA NOTE: STAT is a tri-state logic output on the MCP73831 and an open-drain output on the MCP73832. SOT23-5 with 4.2V output and tri-state logic on STAT = MCP73831T-2ACI/OT
U3 = Athena-A1:AP2112: SOT23-5 Fixed Voltage Regulators Part Current Out V Out V In V Dropout θJA (°C/W) TJ (°C) Digikey Part No. ADP121 150mA 3.3V 3.4-5.5V 0.09V @ 150mA -- -- ADP121-AUJZ33R7CT-ND ADP121 150mA 3.0V 3.1-5.5V 0.09V @ 150mA -- -- ADP121-AUJZ30R7CT-ND ADP122 300mA 3.3V 3.4-5.5V 0.085V @ 300mA -- -- ADP122AUJZ-3.3-R7CT-ND ADP1712 300mA 3.3V 3.5-5.5V 0.17V @ 300mA -- -- ADP1712AUJZ-3.3-R7TR-ND AP7311 (Low Cost) 150mA 3.3V 3.5-6V 0.15V @ 150mA -- -- AP7311-33WG-7DICT-ND LD39015M18R 150mA 1.8V 1.9V-5.5V 0.08V @ 100mA -- -- 497-6977-1-ND LP2985A-33DBVR 150mA 3.3V 3.3-16V 0.28V @ 150mA 206 150 296-18479-1-ND MCP1824T-3302E/OT 300mA 3.3V 3.5V-6V 0.2V @ 300mA -- -- MCP1824T-3302E/OTCT-ND MIC5205-2.5YM5 TR 150mA 2.5V 2.7-16V 0.165V @ 150mA -- -- 576-1257-2-ND MIC5205-3.0YM5 TR 150mA 3.0V 3.2V-16V 0.165V @ 150mA -- -- 576-1258-2-ND MIC5205-3.3YM5 TR 150mA 3.3V 3.5V-16V 0.165V @ 150mA -- -- 576-1259-2-ND TPS780330220 150mA 3.3V+2.2V 3.6-5.5V 250mV Max -- -- 296-23332-1-ND TDA3663/N1,135 100mA 3.3V 3.5-45V 0.18V @ 50mA -- -- 568-5343-1-ND Max operating temp can be calculated using θJA, TJ (max junction temperature), and power in watts. Set the "Maximum Ambient Temperature" until it reaches TJ ("Max Junction Temperature"), which is the absolute limit for safe use of the regulator: Heat Sink Temperature Calculator <http://www.daycounter.com/Calculators/Heat-Sink-Temperature-Calculator.phtml> For example, With 12V source into a 3.3V LP2985 and a 30mA load, we are dissipating (12V-3.3V) * 0.03A = 0.261W. With a θJA of 206 °C/W, a TJ of 150°C, and 261mW we can safely use the chip without a heat sink up to 75°C (=147.1°C Junction Temperature).
U4 = Athena-A1:RT9080-18GJ5
U5 = Athena-A1:MK22FN128VLH10: The Kinetis K22 product family members are optimized for costsensitive applications requiring low-power, USB connectivity, high peripheral integration and processing efficiency with a floating-point unit. These devices share the comprehensive enablement and scalability of the Kinetis family.; PROD_ID: IC-14611
U6 = Athena-A1:IC_MCU_SIFIVE_FE310: SiFive FE310 - RISC-V MCU The FE310-G002 is the second Freedom E300 SoC. The FE310-G002 is built around the E31 Core Complex instantiated in the Freedom E300 platform.; PROD_ID: IC-14494
U7 = Athena-A1:IC_MEMORY_QSPI32MBIT: Integrated Silicon Solution Inc. IS25LP032D The IS25LP032D Serial Flash memory offers a versatile storage solution with high flexibility and performance in a simplified pin count package. ISSI’s “Industry Standard Serial Interface” Flash is for systems that require limited space, a low pin count, and low power consumption. The device is accessed through a 4-wire SPI Interface consisting of a Serial Data Input (SI), Serial Data Output (SO), Serial Clock (SCK), and Chip Enable (CE#) pins, which can also be configured to serve as multi-I/O (see pin descriptions). Datasheet <http://www.issi.com/WW/pdf/25LP-WP032D.pdf>; PROD_ID: IC-14501
X1 = Athena-A1:CONNECTORS_BATT_JST_PH_2PIN: JST 2-Pin Right-Angle Connector PH-Series - 4UConnector: 17311 SH-Series - 4UConnector: 07278
Y1 = Athena-A1:TSX-3225-16.0000MF18X-AC0
Y2 = Athena-A1:KX3211A0032.768000

## Board
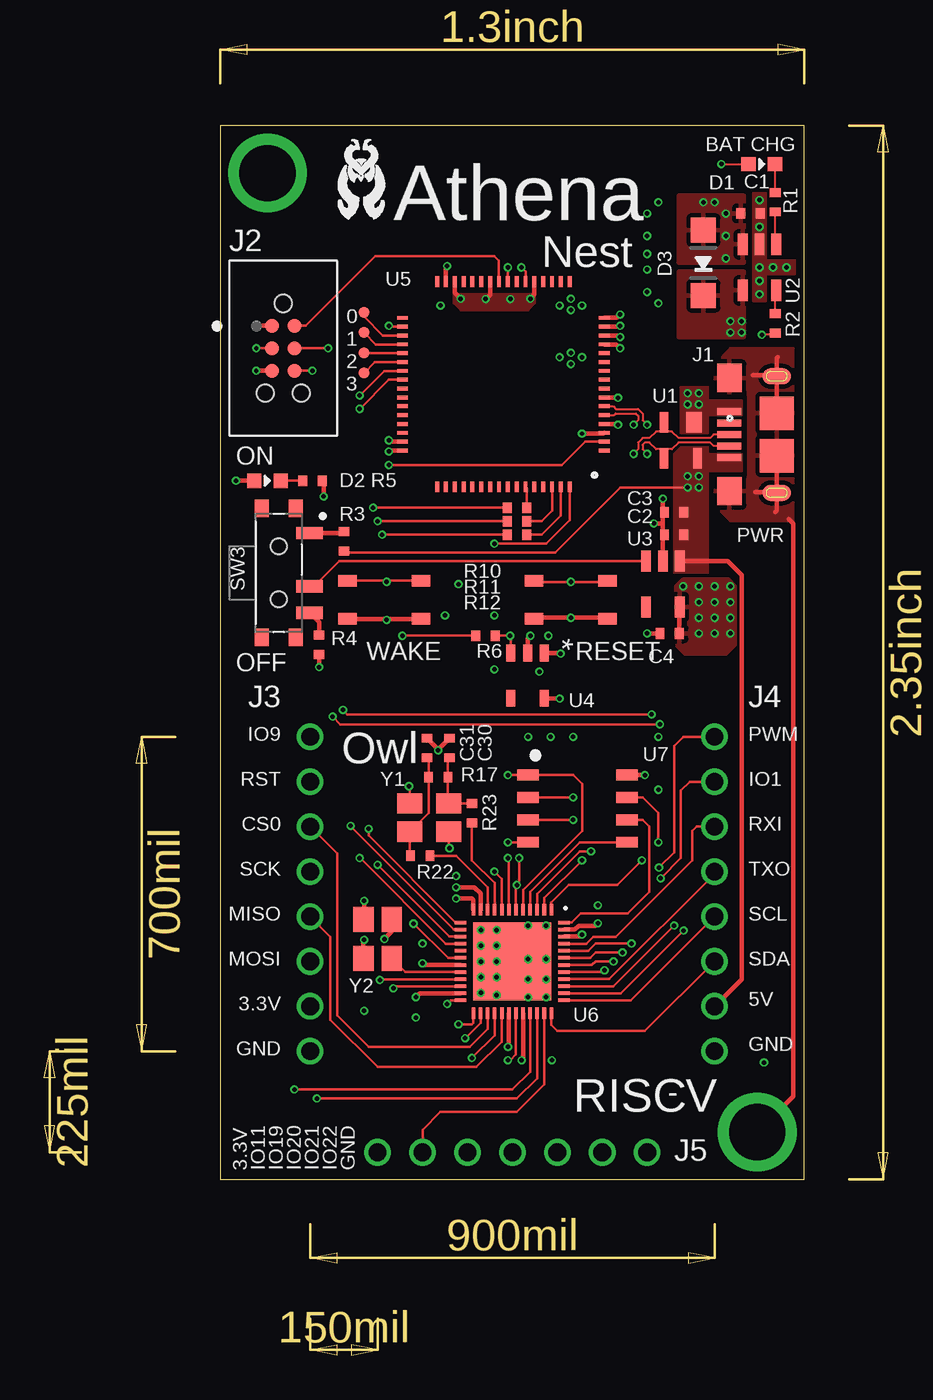
[diagram p6: board, top side]
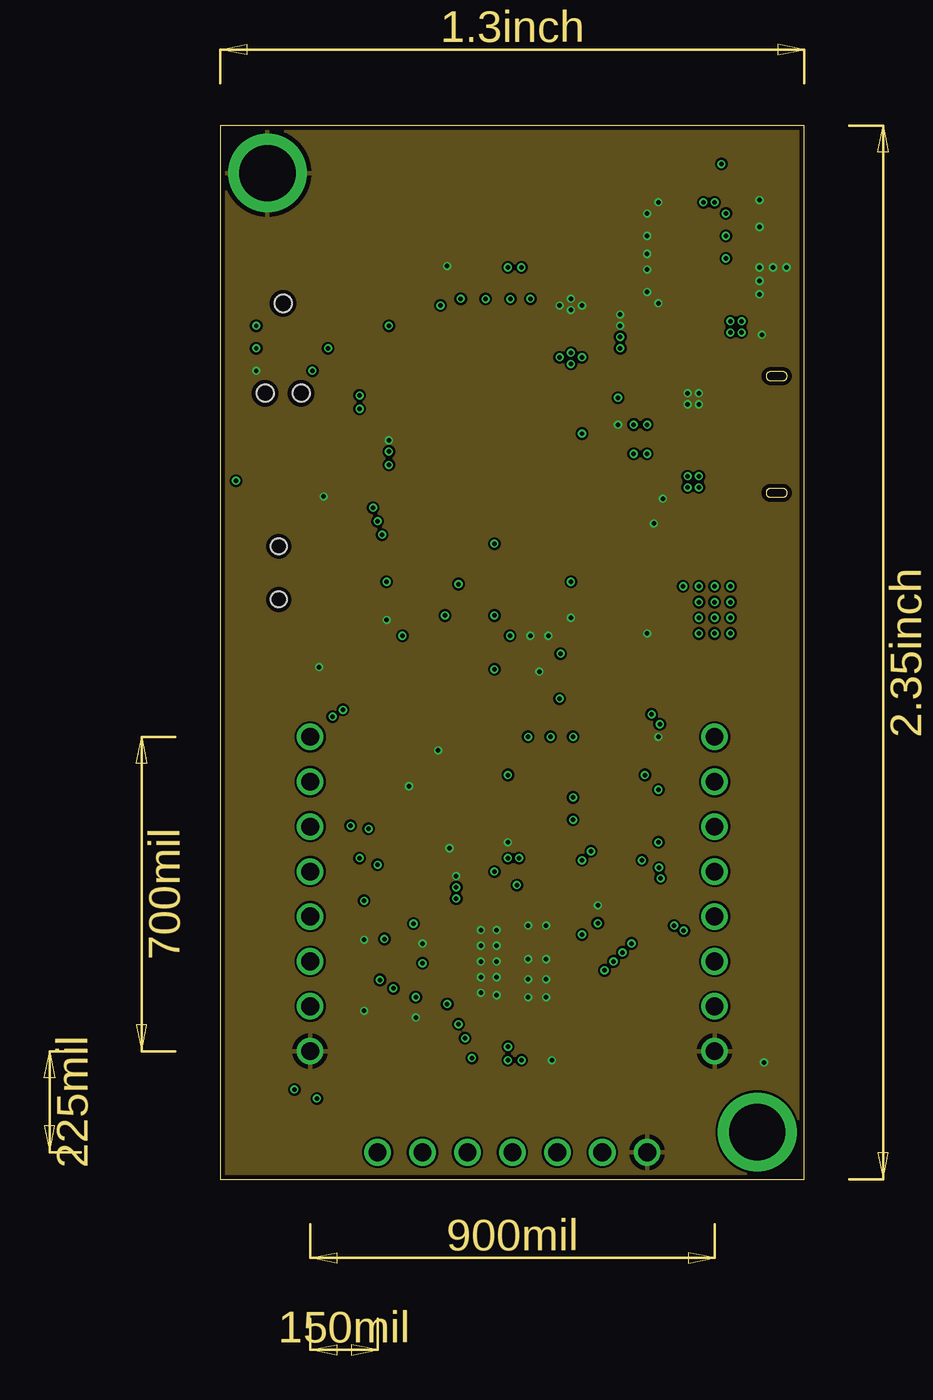
[diagram p7: board, inner layer Route2]
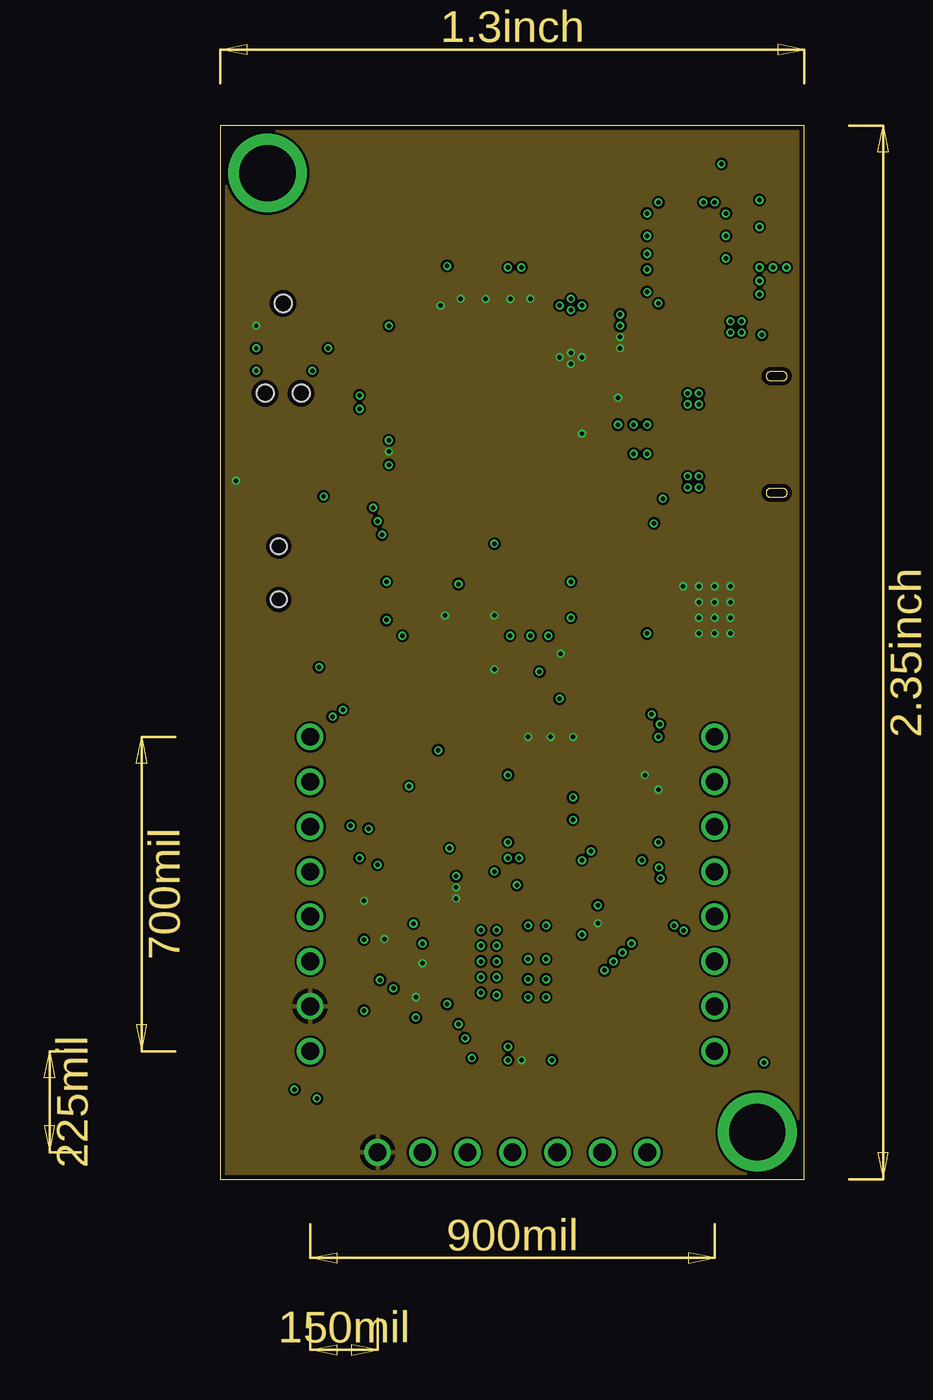
[diagram p8: board, inner layer Route15]
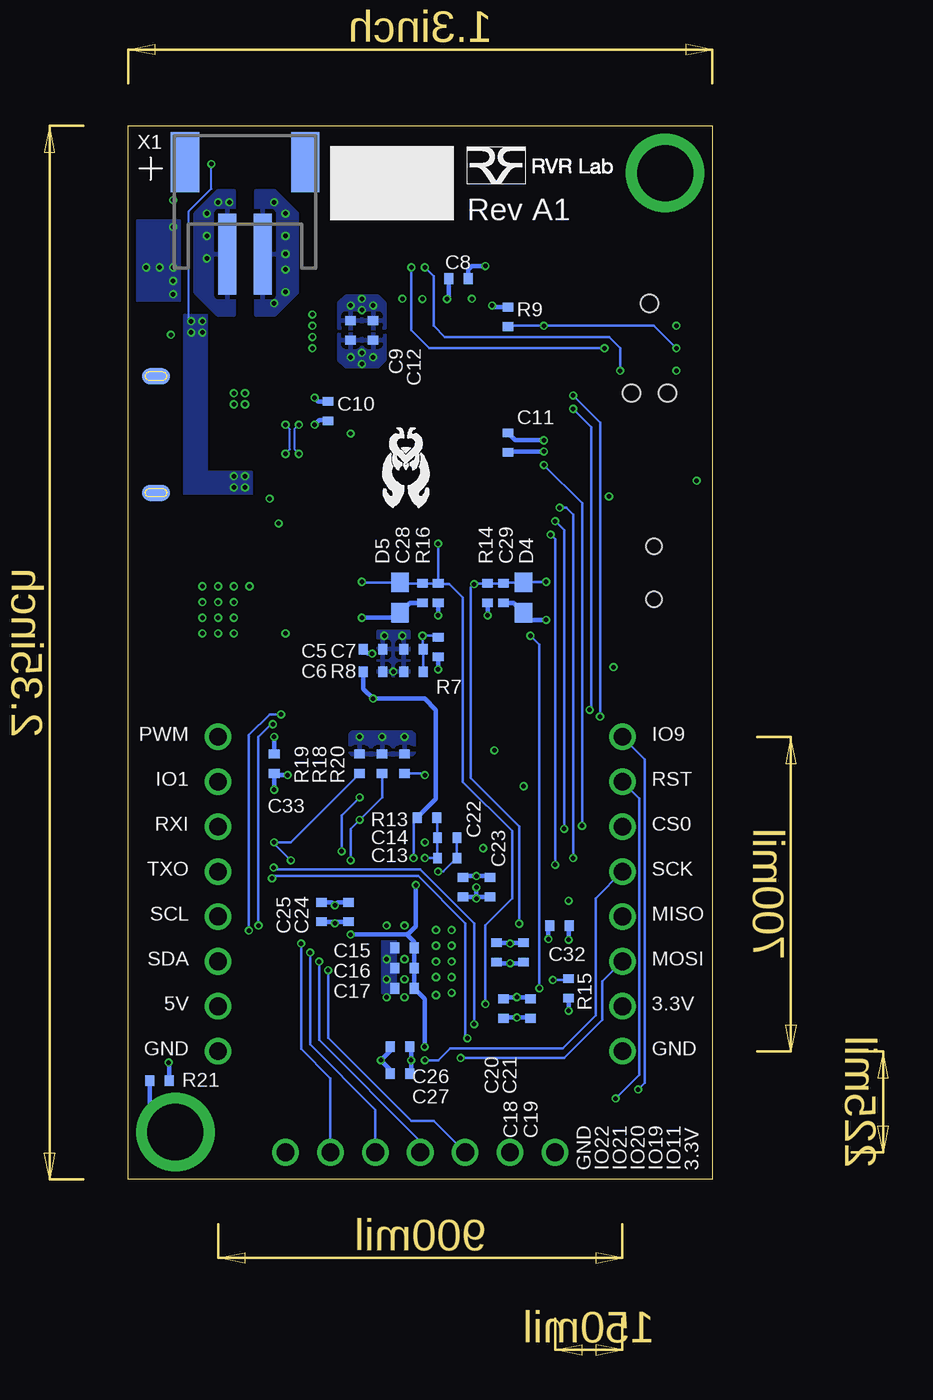
[diagram p9: board, bottom side, seen from below]

Size 33.02 x 59.56 mm. Coordinates in mm from the lower left corner, seen from the top.
Outline: 0,0 33.02,0 33.02,59.56 0.01,59.56 0,0
Copper layers (1*2*15*16): Top 0.035mm / dielectric 0.23mm / Route2 0.035mm / dielectric 0.93mm / Route15 0.035mm / dielectric 0.23mm / Bottom 0.035mm
Design rules "MF_Standard_4_Layer": minimum track width 5mil, minimum drill 10mil, track to track 5mil, track to pad 5mil, pad to pad 5mil, via to via 5mil, smd to smd 0mil, copper to edge 10mil, drill to drill 10mil, minimum pad ring 4mil, minimum via ring 4mil, stop-mask expansion 2mil, vias tented up to drill 25mil, thermal gap 10mil

### Footprints (pad centres in the part's own frame; a part is rotated, then mirrored left to right if it is on the bottom)
TP_B0,65 = smd 0.635 x 0.635: TP 0,0
C0402 = smd 0.5 x 0.6: P$1 -0.55,0; P$2 0.55,0
LED0603 = smd 0.8 x 0.8: ANODE 0.75,0; CATHODE -0.75,0
SOD-123 = smd 1.4 x 1.4: A 1.85,0; C -1.85,0
TVS0603 = smd 1.1 x 1: 1 -0.85,0; 2 0.85,0
MICROUSB-RIGHT = smd 0.4 x 1.35: 1 -1.3,1.27; 2 -0.65,1.27; 3 0,1.27; 4 0.65,1.27; 5 1.3,1.27 | smd 0.9 x 1.6: S1 -3.3,-1.4; S2 3.3,-1.4 | smd 1.6 x 1.4: S3 -3.2,1.27; S4 3.2,1.27 | smd 1.9 x 1.9: S5 -1.2,-1.405; S6 1.2,-1.405 | smd 0.9 x 1.6 bottom: S7 -3.3,-1.4; S8 3.3,-1.4
TAG_TC2030-IDC-NL = smd 0.787 x 0.787: 1 -1.27,-0.635; 2 -1.27,0.635; 3 0,-0.635; 4 0,0.635; 5 1.27,-0.635; 6 1.27,0.635 | hole 0.991: -2.54,0; 2.54,1.016; 2.54,-1.016
PTH_2.54MM_01X08 = drill 1: P$1 -8.89,0; P$2 -6.35,0; P$3 -3.81,0; P$4 -1.27,0; P$5 1.27,0; P$6 3.81,0; P$7 6.35,0; P$8 8.89,0
PTH_2.54MM_01X07 = drill 1: P$1 -7.62,0; P$2 -5.08,0; P$3 -2.54,0; P$4 0,0; P$5 2.54,0; P$6 5.08,0; P$7 7.62,0
MOUNTING_HOLE = drill 3.175 pad 4.445: P$1 0,0
R0402 = smd 0.5 x 0.6: P$1 -0.55,0; P$2 0.55,0
TACT4.2MM = smd 1.05 x 0.65: P$1 -2.075,1.075; P$2 2.075,1.075; P$3 -2.075,-1.075; P$4 2.075,-1.075
SW_PCM12SMTR = smd 0.7 x 1.5: 1 -2.25,1.75; 2 0.75,1.75; 3 2.25,1.75 | smd 1 x 0.8: S1 -3.65,0.965; S2 -3.65,-0.965; S3 3.65,-0.965; S4 3.65,0.965 | hole 0.9: -1.5,0; 1.5,0
SOT143B_PRTR5V0U2X,215_NEX = smd 0.889 x 1.168: 1 -0.747,-1.021 | smd 0.483 x 1.168: 2 0.95,-1.021; 3 0.95,1.021; 4 -0.95,1.021
SOT23-5 = smd 0.55 x 1.2: 1 -0.95,-1.3; 2 0,-1.3; 3 0.95,-1.3; 4 0.95,1.3; 5 -0.95,1.3
TSOT23-5_ONS = smd 0.953 x 0.508: 1 -1.276,0.95; 2 -1.276,0; 3 -1.276,-0.95; 4 1.276,-0.95; 5 1.276,0.95
IC_USB_JTAG_LQFP-64 = smd 0.6 x 0.22: 1 -5.7,3.75; 2 -5.7,3.25; 3 -5.7,2.75; 4 -5.7,2.25; 5 -5.7,1.75; 6 -5.7,1.25; 7 -5.7,0.75; 8 -5.7,0.25; 9 -5.7,-0.25; 10 -5.7,-0.75; 11 -5.7,-1.25; 12 -5.7,-1.75; 13 -5.7,-2.25; 14 -5.7,-2.75; 15 -5.7,-3.25; 16 -5.7,-3.75; 33 5.7,-3.75; 34 5.7,-3.25; 35 5.7,-2.75; 36 5.7,-2.25; 37 5.7,-1.75; 38 5.7,-1.25; 39 5.7,-0.75; 40 5.7,-0.25; 41 5.7,0.25; 42 5.7,0.75; 43 5.7,1.25; 44 5.7,1.75; 45 5.7,2.25; 46 5.7,2.75; 47 5.7,3.25; 48 5.7,3.75 | smd 0.22 x 0.6: 17 -3.75,-5.8; 18 -3.25,-5.8; 19 -2.75,-5.8; 20 -2.25,-5.8; 21 -1.75,-5.8; 22 -1.25,-5.8; 23 -0.75,-5.8; 24 -0.25,-5.8; 25 0.25,-5.8; 26 0.75,-5.8; 27 1.25,-5.8; 28 1.75,-5.8; 29 2.25,-5.8; 30 2.75,-5.8; 31 3.25,-5.8; 32 3.75,-5.8; 49 3.75,5.8; 50 3.25,5.8; 51 2.75,5.8; 52 2.25,5.8; 53 1.75,5.8; 54 1.25,5.8; 55 0.75,5.8; 56 0.25,5.8; 57 -0.25,5.8; 58 -0.75,5.8; 59 -1.25,5.8; 60 -1.75,5.8; 61 -2.25,5.8; 62 -2.75,5.8; 63 -3.25,5.8; 64 -3.75,5.8
MCU_QFN-48-.4MMPITCH = smd 0.65 x 0.2: 1 -2.925,2.2; 2 -2.925,1.8; 3 -2.925,1.4; 4 -2.925,1; 5 -2.925,0.6; 6 -2.925,0.2; 7 -2.925,-0.2; 8 -2.925,-0.6; 9 -2.925,-1; 10 -2.925,-1.4; 11 -2.925,-1.8; 12 -2.925,-2.2; 25 2.925,-2.2; 26 2.925,-1.8; 27 2.925,-1.4; 28 2.925,-1; 29 2.925,-0.6; 30 2.925,-0.2; 31 2.925,0.2; 32 2.925,0.6; 33 2.925,1; 34 2.925,1.4; 35 2.925,1.8; 36 2.925,2.2 | smd 0.2 x 0.65: 13 -2.2,-2.925; 14 -1.8,-2.925; 15 -1.4,-2.925; 16 -1,-2.925; 17 -0.6,-2.925; 18 -0.2,-2.925; 19 0.2,-2.925; 20 0.6,-2.925; 21 1,-2.925; 22 1.4,-2.925; 23 1.8,-2.925; 24 2.2,-2.925; 37 2.2,2.925; 38 1.8,2.925; 39 1.4,2.925; 40 1,2.925; 41 0.6,2.925; 42 0.2,2.925; 43 -0.2,2.925; 44 -0.6,2.925; 45 -1,2.925; 46 -1.4,2.925; 47 -1.8,2.925; 48 -2.2,2.925 | smd 4.4 x 4.4: 49 0,0
IC-MEMORY_SO08 = smd 0.6 x 1.2: 1 -1.905,-2.8; 2 -0.635,-2.8; 3 0.635,-2.8; 4 1.905,-2.8; 5 1.905,2.8; 6 0.635,2.8; 7 -0.635,2.8; 8 -1.905,2.8
JSTPH2 = smd 1 x 4.6: 1 -1,-3.7; 2 1,-3.7 | smd 1.6 x 3.4: NC1 -3.4,1.5; NC2 3.4,1.5
SMD-4 = smd 1.4 x 1.15: 1 -1.1,-0.8; 2 1.1,-0.8; 3 1.1,0.8; 4 -1.1,0.8

### Placement (x,y rotation side)
0  8.13,49.02 0 top
1  8.13,47.88 0 top
2  8.13,46.74 0 top
3  8.13,45.59 0 top
C1  29.97,54.61 0 top
C2  25.65,36.45 180 top
C3  25.65,37.72 180 top
C4  25.4,30.86 180 top
C5  19.18,29.97 0 bottom
C6  19.18,28.7 0 bottom
C7  16.89,29.97 180 bottom
C8  14.35,50.93 0 bottom
C9  20.45,48.01 90 bottom
C10  21.72,43.43 270 bottom
C11  11.56,41.66 90 bottom
C12  19.18,48.01 90 bottom
C13  14.99,18.16 0 bottom
C14  14.99,19.3 0 bottom
C15  17.4,13.08 180 bottom
C16  17.4,11.94 180 bottom
C17  17.4,10.79 180 bottom
C18  11.81,9.65 270 bottom
C19  10.29,9.65 270 bottom
C20  12.19,12.83 90 bottom
C21  10.67,12.83 90 bottom
C22  14.1,16.51 90 bottom
C23  12.57,16.51 90 bottom
C24  20.57,15.11 90 bottom
C25  22.1,15.11 90 bottom
C26  17.65,7.49 180 bottom
C27  17.65,5.97 180 bottom
C28  16.38,33.15 270 bottom
C29  11.81,33.15 270 bottom
C30  12.95,24.38 90 top
C31  11.68,24.38 90 top
C32  8.64,14.35 0 bottom
C33  24.77,23.5 90 bottom
D1  30.61,57.4 180 top
D2  2.67,39.5 180 top
D3  27.3,51.82 90 top
D4  10.67,32.89 90 bottom
D5  17.65,32.89 90 bottom
J1  30.05,42.11 90 top
J2  3.56,46.99 270 top
J3  5.08,16.13 270 top
J4  27.94,16.13 270 top
J5  16.51,1.52 0 top
MGT1  30.35,2.67 0 top
MGT2  2.67,56.9 0 top
R1  31.37,55.24 270 top
R2  31.37,48.39 90 top
R3  6.99,36.07 270 top
R4  5.59,30.23 270 top
R5  5.21,39.5 0 top
R6  14.99,30.73 0 top
R7  15.49,30.1 270 bottom
R8  16.89,28.7 0 bottom
R9  11.56,48.77 270 bottom
R10  16.76,37.97 180 top
R11  16.76,37.21 180 top
R12  16.76,36.45 0 top
R13  16.13,20.45 0 bottom
R14  12.7,33.15 90 bottom
R15  8.13,10.79 270 bottom
R16  15.49,33.15 90 bottom
R17  12.32,22.73 180 top
R18  18.67,23.5 270 bottom
R19  19.94,23.5 270 bottom
R20  17.4,23.5 270 bottom
R21  31.24,5.59 0 bottom
R22  11.3,18.29 0 top
R23  14.22,20.7 90 top
SW1  9.27,32.77 180 top
SW2  19.81,32.77 180 top
SW3  3.3,34.29 270 top
U1  26.04,41.78 180 top
U2  30.48,51.56 180 top
U3  25.02,33.66 180 top
U4  17.37,28.47 270 top
U5  16,44.96 180 top
U6  16.51,12.32 270 top
U7  20.19,20.95 270 top
X1  26.42,56.01 0 bottom
Y1  11.81,20.45 180 top
Y2  8.89,13.59 270 top

### Tracks (layer width: path | path; a pad name or v marks a point on that pad's centre or on a via)
1.8V  (via drill 0.25)
  Top 0.152: U6.6 16.71,16.56 | v16.76,16.64 16.76,16.62 16.71,16.56 | v16.89,18.16 16.89,16.89 16.71,16.71 16.71,16.56
  Top 0.254: U4.5 19.16,27.2 v19.18,27.18 | U6.30 16.31,7.54 v16.26,7.49 | U6.46 20.32,13.72 v20.45,13.84
  Bottom 0.152: R13.P$1 16.89,20.45 v16.89,18.16
  Bottom 0.254: C6.P$1 19.73,27.73 v19.18,27.18 16.26,27.18 15.62,26.54 15.62,21.5 R13.P$1 | 17.27,13.84 v20.45,13.84 | 17.27,13.84 16.85,13.42 C15.P$1 C16.P$1 C17.P$1 16.26,10.21 v16.26,7.49 | 17.27,13.84 17.25,13.87 17.2,13.87 16.76,14.3 v16.76,16.64
3.3V  (via drill 0.25)
  Top 0.152: 9.59,41.21 v9.53,41.15
  Top 0.254: U5.48 9.59,41.21 | U5.30 13.25,50.12 v13.59,49.78 | U5.26 15.25,50.03 v15,49.77 | U5.21 17.75,50.01 v17.53,49.78 | U5.7 22.47,44.21 v22.48,44.2 | U5.14 22.52,47.71 v22.61,47.62 | U5.13 22.39,47.21 v22.61,46.99 | C4.P$1 25.95,32.34 U3.5 | D2.ANODE v0.89,39.5 | U4.1 19.2,29.75 v19.23,29.72 | U6.23 11.27,10.52 v11.05,10.3 | U6.19 11.53,12.12 v11.43,12.21 | U7.8 v24,22.86 | U6.32 17.11,6.81 v17.03,6.73 | U6.47 20.04,14.12 20.25,14.33 21.18,14.33 v21.34,14.48 | U6.11 14.71,16.15 14.35,16.51 v13.34,16.51 | U6.12 14.31,15.79 14.22,15.88 v13.34,15.88 | v8.13,15.75 8.13,14.73 Y2.1 | Y2.4 9.69,14.01 v9.27,13.59 | J2.1 v2.03,48.26 | U5.3 21.66,42.16 v20.45,42.16
  Bottom 0.152: 17.03,7.42 C26.P$1 | C21.P$1 10.73,12.21 | 11.52,41.15 C11.P$1
  Bottom 0.254: 10.73,12.21 v11.43,12.21 12.13,12.21 C20.P$1 | v9.53,41.15 11.52,41.15 | R9.P$1 12.36,49.32 v12.45,49.4 | C8.P$1 14.9,49.87 v15,49.77 | C10.P$1 22.27,43.98 v22.48,44.2 | C5.P$1 19.47,29.72 v19.23,29.72 | C19.P$1 10.38,10.3 v11.05,10.3 11.72,10.3 C18.P$1 | v24,22.86 24.68,22.86 C33.P$1 v24.77,22.03 | C27.P$1 17.03,6.04 v17.03,6.73 17.03,7.42 | C24.P$1 21.25,14.56 v21.34,14.48 21.42,14.56 C25.P$1 | C23.P$1 13.25,15.96 v13.34,15.88 | v13.34,15.88 13.42,15.96 C22.P$1 | v13.34,16.51 v13.34,15.88 | C32.P$1 9.27,14.27 v9.27,13.59 | R14.P$1 v12.7,31.88 | v15.49,31.88 R16.P$1 | R7.P$2 v15.49,28.83
  other vias: 17.4,25.02 18.67,25.02 19.94,25.02 16.4,49.77 20.45,46.48 19.81,46.74 19.18,46.48 19.81,46.1 27.05,30.86 27.05,31.75 27.05,32.64 27.05,33.53 27.94,33.53 27.94,32.64 27.94,31.75 27.94,30.86 28.83,30.86 28.83,31.75 28.83,32.64 28.83,33.53 26.16,33.53
  pour Route15: -0.76,60.2 33.78,60.2 33.78,-0.89 -0.76,-0.89
  pour Top: 13.21,50.04 13.21,49.53 13.59,49.15 17.4,49.15 17.78,49.53 17.78,50.04
  pour Bottom: 20.7,45.97 18.92,45.97 18.54,46.35 18.54,47.75 21.08,47.75 21.08,46.35
  pour Top: 25.78,33.53 25.78,30.23 26.29,29.72 28.57,29.72 29.08,30.23 29.08,33.53 28.7,33.91 26.16,33.91
  pour Bottom: 16.89,25.15 16.89,24.13 17.02,24 20.32,24 20.45,24.13 20.45,25.15 20.32,25.27 17.02,25.27
16MHZ_IN
  Top 0.152: U6.9 15.51,16.75 14.22,18.03 R23.P$1
16MHZ_OUT
  Top 0.152: U6.10 15.11,16.51 13.34,18.29 R22.P$2
32KHZ_CLK
  Top 0.152: U6.20 10.46,11.72 Y2.3
CGND
  Top 0.254: 30.78,40.91 J1.S5 J1.S1 | 30.78,43.31 J1.S6 J1.S2 | MGT1.P$1 32.38,4.7 32.38,37.08 32.13,37.34 | J1.S2 31.45,46.43 31.5,46.48 | J1.S2 31.39,45.47 30.1,45.47 | J1.S1 31.4,38.86 30.23,38.86 | J1.S1 31.45,37.8 31.37,37.72
  Bottom 0.254: MGT1.P$1 31.79,4.11 R21.P$1
  pour Top: 32.38,46.99 28.83,46.99 27.94,46.1 27.94,44.83 28.32,44.45 29.72,44.45 29.84,44.32 29.84,39.75 29.72,39.62 28.07,39.62 27.94,39.5 27.94,38.1 28.83,37.21 32.38,37.21
CS0
  Top 0.152: J3.P$3 6.6,18.41 6.6,9.27 8.38,7.49 14.1,7.49 15.11,8.51 U6.27
DBG_RESET  (via drill 0.25)
  Top 0.152: U5.34 9.58,48.21 v9.53,48.26 | J2.3 v2.03,46.99
  Bottom 0.152: R9.P$2 11.52,48.26 v9.53,48.26 3.3,48.26 v2.03,46.99
DBG_SWDCLK  (via drill 0.25)
  Top 0.152: v6.1,46.99 J2.4 | v17.02,51.56 17.25,51.33 U5.22
  Bottom 0.152: v6.1,46.99 16,46.99 17.02,48.01 v17.02,51.56
DBG_SWDIO
  Top 0.152: U5.25 15.75,51.94 15.49,52.2 8.76,52.2 4.83,48.26 J2.2
DBG_SWO  (via drill 0.25)
  Top 0.152: J2.6 v5.21,45.72 | v16.26,51.56 U5.24
  Bottom 0.152: v5.21,45.72 5.21,46.99 5.84,47.62 15.11,47.62 15.75,48.26 15.75,51.05 v16.26,51.56
GND  (via drill 0.25)
  Top 0.127: R2.P$1 31.28,47.75 v30.61,47.75
  Top 0.152: U7.4 v16.26,19.05 | Y1.4 12.91,18.76 v12.95,18.72 | Y1.2 10.71,22.18 v10.67,22.23 | 9.6,41.71 v9.53,41.78
  Top 0.254: U5.47 9.6,41.71 | U5.31 12.75,51.56 v12.83,51.64 | U5.4 22.44,42.71 v22.48,42.67 | 25.02,37.08 25.02,36.53 C2.P$2 25.02,36.36 U3.2 | 25.02,37.08 25.02,37.63 C3.P$2 25.02,37.8 v25.02,38.48 | 25.02,37.08 v24.51,37.08 | v22.61,48.26 22.55,48.21 U5.15 | U5.16 22.42,48.71 v22.61,48.9 | R5.P$2 5.84,39.41 v5.84,38.61 | U4.2 17.37,30.58 v17.53,30.73 | C4.P$2 v24.13,30.86 | Y2.2 8.09,13.51 v8.13,13.54 | C31.P$2 12.32,24.3 | 12.32,24.3 v12.32,24.26 | C30.P$2 12.32,24.3 | SW2.P$1 21.83,31.75 v19.81,31.75 17.8,31.75 SW2.P$2 | SW1.P$2 9.33,31.69 v9.4,31.62 9.47,31.69 SW1.P$1 | J2.5 v2.03,45.72 | R4.P$2 v5.59,28.96
  Bottom 0.152: 11.47,13.38 v11.43,13.34 11.39,13.38
  Bottom 0.254: C20.P$2 11.47,13.38 | C21.P$2 11.39,13.38 | C11.P$2 11.13,41.78 v9.53,41.78 | C8.P$2 13.8,51.44 13.6,51.64 v12.83,51.64 | C10.P$2 21.76,42.93 22.23,42.93 v22.48,42.67 | R21.P$2 30.69,6.56 v30.73,6.6 | C33.P$2 v24.77,25.02 | C27.P$2 18.2,6.19 v18.74,6.73 18.2,7.27 C26.P$2 | C24.P$2 21.17,15.66 v21.34,15.49 21.5,15.66 C25.P$2 | C23.P$2 12.66,17.14 v13.34,17.14 14.01,17.14 C22.P$2 | C18.P$2 11.77,9.14 v11.05,9.14 10.33,9.14 C19.P$2 | R15.P$2 v8.13,9.53 | C32.P$2 8.13,14.31 v8.13,13.54 | v9.4,31.62 10.25,31.62 D4.1 11.22,32.6 C29.P$2 | C28.P$2 17.1,32.6 D5.1 17.95,31.75 v19.81,31.75
  other vias: 20.45,49.4 19.81,49.15 19.18,49.4 26.42,44.45 27.05,44.45 19.81,49.78 24.13,52.32 24.77,55.24 24.13,54.61 24.13,50.16 24.13,51.44 24.13,53.34 30.48,53.85 18.54,30.73 18.03,28.7 14.73,14.1 15.62,14.1 17.4,14.35 14.73,12.32 14.73,10.54 18.41,14.35 18.41,10.29 17.4,11.3 17.4,12.45 17.4,10.29 15.62,12.32 15.62,13.21 14.73,11.43 14.73,13.21 18.41,12.45 18.41,11.3 15.62,11.43 15.62,10.41 26.42,43.81 27.05,43.81 24.77,49.53 30.48,55.37 30.48,51.56 30.48,50.04 30.48,50.8 31.24,51.56 32,51.56
  pour Route2: -1.52,61.09 34.54,61.09 34.54,-1.65 -1.52,-1.65
  pour Bottom: 20.7,49.91 18.92,49.91 18.54,49.53 18.54,48.13 21.08,48.13 21.08,49.53
  pour Bottom: 25.78,48.9 25.78,55.88 24.77,55.88 23.5,54.61 23.5,50.16 24.77,48.9
  pour Bottom: 18.92,30.99 17.14,30.99 17.14,28.45 18.92,28.45
  pour Top: 14.48,14.35 14.48,10.29 18.54,10.29 18.54,14.35
  pour Bottom (no thermals): 17.91,13.46 17.91,10.54 18.67,10.54 18.67,13.46
  pour Top (no thermals): 29.46,43.18 27.56,43.18 27.56,42.16 26.04,42.16 26.04,44.83 27.56,44.83 27.56,44.07 29.46,44.07
  pour Top (no thermals): 30.1,55.75 30.1,49.66 30.86,49.66 30.86,51.18 32.51,51.18 32.51,51.94 30.86,51.94 30.86,55.75
  pour Bottom: 30.1,49.66 32.51,49.66 32.51,54.23 30.1,54.23
IO1  (via drill 0.25)
  Top 0.152: U6.26 14.71,8.84 v13.84,7.97 | v24.89,17.02 26.04,18.16 26.04,21.97 26.54,22.48 J4.P$2
  Bottom 0.152: v13.84,7.97 13.97,8.1 13.97,14.48 16.64,17.14 24.77,17.14 v24.89,17.02
IO9  (via drill 0.25)
  Top 0.152: U6.33 17.51,6.08 16.51,5.08 v4.19,5.08
  Bottom 0.152: v4.19,5.08 3.81,5.46 3.81,23.75 J3.P$1
IO11
  Top 0.152: J5.P$2 11.43,2.79 12.45,3.81 16.76,3.81 18.31,5.36 U6.35
IO19  (via drill 0.25)
  Top 0.152: U6.41 21.62,11.72 v21.72,11.81
  Bottom 0.152: v21.72,11.81 21.72,8 17.02,3.3 15.75,3.3 J5.P$3
IO20  (via drill 0.25)
  Top 0.152: U6.42 21.01,12.12 21.21,12.32 v22.23,12.32
  Bottom 0.152: v22.23,12.32 22.23,7.87 16.51,2.16 J5.P$4
IO21  (via drill 0.25)
  Top 0.152: U6.43 20.9,12.52 21.21,12.83 v22.73,12.83
  Bottom 0.152: v22.73,12.83 22.73,7.62 19.05,3.94 J5.P$5
IO22  (via drill 0.25)
  Top 0.152: U6.44 20.79,12.92 21.21,13.34 v23.24,13.34
  Bottom 0.152: J5.P$6 21.59,5.71 23.24,7.37 v23.24,13.34
JTAG_TCK  (via drill 0.25)
  Top 0.152: U6.13 13.29,14.52 8.38,19.43 v8.38,19.81 | v8.89,37.21 R11.P$2
  Bottom 0.152: v8.89,37.21 8.38,36.7 v8.38,19.81
JTAG_TDI  (via drill 0.25)
  Top 0.152: U6.16 12.74,13.32 7.9,18.16 v7.87,18.16 | R10.P$2 v8.64,37.97
  Bottom 0.152: v8.64,37.97 8.26,37.97 7.87,37.59 v7.87,18.16
JTAG_TDO  (via drill 0.25)
  Top 0.152: U6.14 13.19,14.12 7.37,19.94 v7.37,19.99 | U5.2 20.63,41.71 19.3,40.39 v9.53,40.39
  Bottom 0.152: v7.37,19.99 7.37,38.23 v9.53,40.39
JTAG_TMS  (via drill 0.25)
  Top 0.152: U6.15 12.95,13.72 v8.89,17.78 | v9.14,36.45 R12.P$1
  Bottom 0.152: v8.89,17.78 8.89,35.31 8.89,35.56 8.89,36.2 v9.14,36.45
MISO
  Top 0.152: J3.P$5 6.22,13.72 6.22,9.02 8.89,6.35 14.48,6.35 15.91,7.78 U6.29
MOSI  (via drill 0.25)
  Top 0.152: v14.22,6.86 15.51,8.14 U6.28
  Bottom 0.152: J3.P$6 6.22,11.18 6.22,9.02 8.38,6.86 v14.22,6.86
N$1
  Top 0.254: SW3.1 6.77,36.54 R3.P$1
N$2
  Top 0.152: D2.CATHODE R5.P$1
N$3
  Top 0.127: R1.P$1 31.36,55.81 D1.CATHODE
N$4  (via drill 0.25)
  Top 0.152: U4.3 16.42,30.69 v16.38,30.73 R6.P$2
  Bottom 0.152: R8.P$2 C7.P$1 16.38,30.01 v16.38,30.73 15.58,30.73 R7.P$1
N$5
  Top 0.127: R2.P$2 31.37,50.2 U2.5
N$6
  Top 0.127: U2.1 31.37,52.92 R1.P$2
N$7  (via drill 0.25)
  Top 0.152: v9.02,11.27 9.05,11.3 13.57,11.3 U6.21
  Bottom 0.152: v9.02,11.27 8.2,11.27 R15.P$1
N$8
  Top 0.152: R12.P$2 18.16,36.45 19.25,37.54 U5.63
N$9
  Top 0.152: R11.P$1 18.16,37.21 18.75,37.8 U5.62
N$10  (via drill 0.25)
  Top 0.152: U6.8 15.91,16.98 v15.49,17.4
  Bottom 0.152: C14.P$2 C13.P$2 15.2,17.4 v15.49,17.4
N$11
  Top 0.152: U5.59 17.31,39.1 R10.P$1
N$12
  Top 0.152: U5.35 9.19,47.71 8.13,48.77 0.TP
N$13
  Top 0.152: U5.36 8.8,47.21 1.TP
N$14
  Top 0.152: U5.37 8.16,46.71 2.TP
N$15
  Top 0.152: U5.38 8.74,46.21 3.TP
N$16
  Top 0.152: SW3.2 5.31,33.54 6.72,34.95 U3.3
N$17
  Top 0.254: SW3.3 5.59,31.5 R4.P$1
N$18
  Top 0.152: R23.P$2 Y1.1 12.87,21.29 R17.P$1 12.87,23.75 C30.P$1
N$19
  Top 0.152: R22.P$1 10.71,18.33 Y1.3 11.77,20.7 R17.P$2 11.77,23.75 C31.P$1
PLL_AVDD  (via drill 0.25)
  Top 0.152: v16.26,18.16 16.31,18.11 U6.7
  Bottom 0.152: R13.P$2 15.54,20.4 C14.P$1 C13.P$1 v16.26,18.16
PWM  (via drill 0.25)
  Top 0.152: U6.25 14.31,8.85 14.22,8.76 v13.46,8.76 | v24.8,17.62 25.65,18.48 25.65,24.51 26.16,25.02 J4.P$1
  Bottom 0.152: v13.46,8.76 13.46,14.48 16.51,17.53 24.7,17.53 v24.8,17.62
QSPI_CS  (via drill 0.25)
  Top 0.152: U6.5 17.11,15.92 17.12,15.93 17.12,16.36 20.45,19.68 20.45,22.35 19.94,22.86 U7.1 v16.26,22.86
  Bottom 0.152: R20.P$2 16.34,22.95 v16.26,22.86
QSPI_DQ0
  Top 0.152: U6.4 17.51,16.24 20.32,19.05 U7.5
QSPI_DQ1  (via drill 0.25)
  Top 0.152: U6.3 17.91,16.13 20.32,18.54 v20.95,18.54 | v19.94,21.59 U7.2
  Bottom 0.152: v19.94,21.59 20.95,20.57 v20.95,18.54
QSPI_DQ2  (via drill 0.25)
  Top 0.152: U6.2 18.31,15.9 v20.45,18.03 | v19.94,20.32 U7.3
  Bottom 0.152: v20.45,18.03 20.45,19.81 v19.94,20.32 18.67,21.59 R18.P$2
QSPI_DQ3  (via drill 0.25)
  Top 0.152: U6.1 18.71,15.66 19.68,16.64 22.43,16.64 v23.82,18.03 | U7.7 23.88,21.59 24.77,20.7 v24.77,19.05
  Bottom 0.152: v23.82,18.03 24.77,18.97 v24.77,19.05 23.83,19.05 R19.P$2
QSPI_SCK
  Top 0.152: U6.48 19.85,14.52 20.37,15.04 23.04,15.04 24.26,16.26 24.26,19.94 23.88,20.32 U7.6
RESET  (via drill 0.25)
  Top 0.152: U6.24 13.04,10.12 v12.83,9.91 | SW2.P$4 17.8,33.78 v19.81,33.78 21.83,33.78 SW2.P$3 | U5.64 19.75,37.28 18.41,35.94 v15.49,35.94
  Bottom 0.152: v12.83,9.91 12.83,14.35 11.3,15.88 11.3,19.68 14.1,22.48 14.1,32.89 14.86,33.66 15.45,33.66 R16.P$2 | R16.P$2 C28.P$1 17.61,33.7 D5.2 19.77,33.74 v19.81,33.78 | v15.49,35.94 R16.P$2
RST  (via drill 0.25)
  Top 0.152: U6.34 17.91,5.72 16.76,4.57 v5.46,4.57
  Bottom 0.152: v5.46,4.57 4.13,5.91 4.13,21.53 J3.P$2
RXI
  Top 0.152: J4.P$3 26.92,19.94 26.67,19.68 26.67,18.03 22.35,13.72 21.08,13.72 20.68,13.32 U6.45
SCK  (via drill 0.25)
  Top 0.152: U6.31 16.71,7.06 16.38,6.73 v16.26,6.73
  Bottom 0.152: J3.P$4 6.6,15.88 6.6,9.27 8.46,7.41 14.81,7.41 15.49,6.73 v16.26,6.73
SCL
  Top 0.152: U6.37 23.2,10.12 J4.P$5
SDA
  Top 0.152: U6.36 18.71,8.72 19.05,8.38 24,8.38 J4.P$6
TXO
  Top 0.152: U6.40 21.99,11.32 27.94,17.27 J4.P$4
UART_RX_MK22  (via drill 0.25)
  Top 0.152: U6.39 22.22,10.92 v25.65,14.35 | U5.39 9.26,45.71 v7.87,44.32 | v24.84,25.73 6.78,25.73 v6.35,26.16
  Bottom 0.152: v25.65,14.35 25.65,25.02 24.89,25.78 v24.84,25.73 | v7.87,44.32 6.35,42.8 v6.35,26.16
UART_TX_MK22  (via drill 0.25)
  Top 0.152: U5.40 9.52,45.21 v7.87,43.56 | v26.19,14.06 22.65,10.52 U6.38 | v24.38,26.29 7.19,26.29 v6.93,26.54
  Bottom 0.152: v7.87,43.56 6.86,42.55 6.86,26.62 v6.93,26.54 | v26.19,14.06 26.19,25.11 25.02,26.29 v24.38,26.29
USB_N  (via drill 0.25 pad 0.46)
  Top 0.127: U5.6 22.2,43.71 22.35,43.56 23.62,43.56 23.88,43.31 23.88,42.93 v24.13,42.67 | J1.2 27.88,41.46 27.69,41.66 25.91,41.66 25.53,41.27 25.27,41.27 25.09,41.09 U1.3 25.09,41.14 24.95,41.27 24.64,41.27 24.26,41.66 24,41.66 23.88,41.53 23.88,41.27 v24.13,41.02
  Bottom 0.127: v24.13,41.02 23.88,41.27 23.88,42.42 v24.13,42.67
USB_P  (via drill 0.25 pad 0.46)
  Top 0.127: U5.5 22.25,43.21 22.35,43.31 23.5,43.31 23.62,43.18 23.62,42.93 v23.37,42.67 | J1.3 27.89,42.11 27.69,41.91 25.91,41.91 25.53,42.29 25.27,42.29 25.09,42.48 U1.2 25.09,42.42 24.95,42.29 24.64,42.29 24.26,41.91 23.88,41.91 23.62,41.66 23.62,41.27 v23.37,41.02
  Bottom 0.127: v23.37,42.67 23.62,42.42 23.62,41.27 v23.37,41.02
V_BATT  (via drill 0.25)
  other vias: 28.57,52.07 28.57,53.34 28.57,54.61 27.94,55.24 27.3,55.24
  pour Top: 29.59,55.63 25.91,55.63 25.91,51.82 29.59,51.82
  pour Bottom: 27.05,48.9 27.05,55.88 27.94,55.88 29.21,54.61 29.21,50.16 27.94,48.9
V_USB  (via drill 0.25 pad 0.46)
  Top 0.127: v28.32,57.4 D1.ANODE
  Top 0.152: v26.42,39.12 22.61,39.12 18.92,35.43 7.07,35.43
  Top 0.254: J4.P$7 29.46,11.3 29.46,34.16 28.67,34.95 U3.1 | R3.P$2 7.07,35.43
  Bottom 0.127: v29.46,48.51 29.59,48.64 29.59,54.74 28.32,56.01 v28.32,57.4
  other vias: 26.42,39.75 27.05,39.75 27.05,39.12 28.83,47.88 29.46,47.88 28.83,48.51
  pour Top: 25.91,51.31 25.91,47.62 29.59,47.62 29.59,51.31
  pour Top (no thermals): 29.46,41.02 29.46,40.01 27.56,40.01 27.56,34.29 25.65,34.29 25.65,41.02 26.04,41.4 27.56,41.4 27.56,41.02
  pour Bottom: 26.04,38.73 29.84,38.73 29.84,48.9 28.57,48.9 28.57,40.01 26.04,40.01
VDD_CORE_EN  (via drill 0.25)
  Top 0.152: v9.78,10.79 9.9,10.92 U6.22 | R6.P$1 v10.29,30.73
  Bottom 0.152: v10.29,30.73 9.78,30.23 v9.78,10.79
WAKE  (via drill 0.25)
  Top 0.152: U6.18 12.88,12.52 10.95,14.45 v10.92,14.45 | SW1.P$4 9.34,33.84 v9.4,33.78 9.46,33.84 SW1.P$3
  Bottom 0.152: v10.92,14.45 10.92,19.94 13.66,22.68 13.66,33.45 v13.46,33.66 13.42,33.7 R14.P$2 C29.P$1 11.77,33.74 D4.2 10.63,33.78 v9.4,33.78

### Text on the board
tNames: BAT CHG | Athena | Nest | ON | PWR | OFF | WAKE | RESET | IO9 | PWM | Owl | RST | IO1 | CS0 | RXI | SCK | TXO | MISO | SCL | MOSI | SDA | 3.3V | 5V | GND | GND | RISC | - | V | 3.3V | IO11 | IO19 | IO20 | IO21 | IO22 | GND
bNames: Rev A1 | IO9 | PWM | RST | IO1 | CS0 | RXI | SCK | TXO | MISO | SCL | MOSI | SDA | 3.3V | 5V | GND | GND | 3.3V | IO11 | IO19 | IO20 | IO21 | IO22 | GND